# EAGLE board core (EAGLE 9.6.2), part 1 of 4
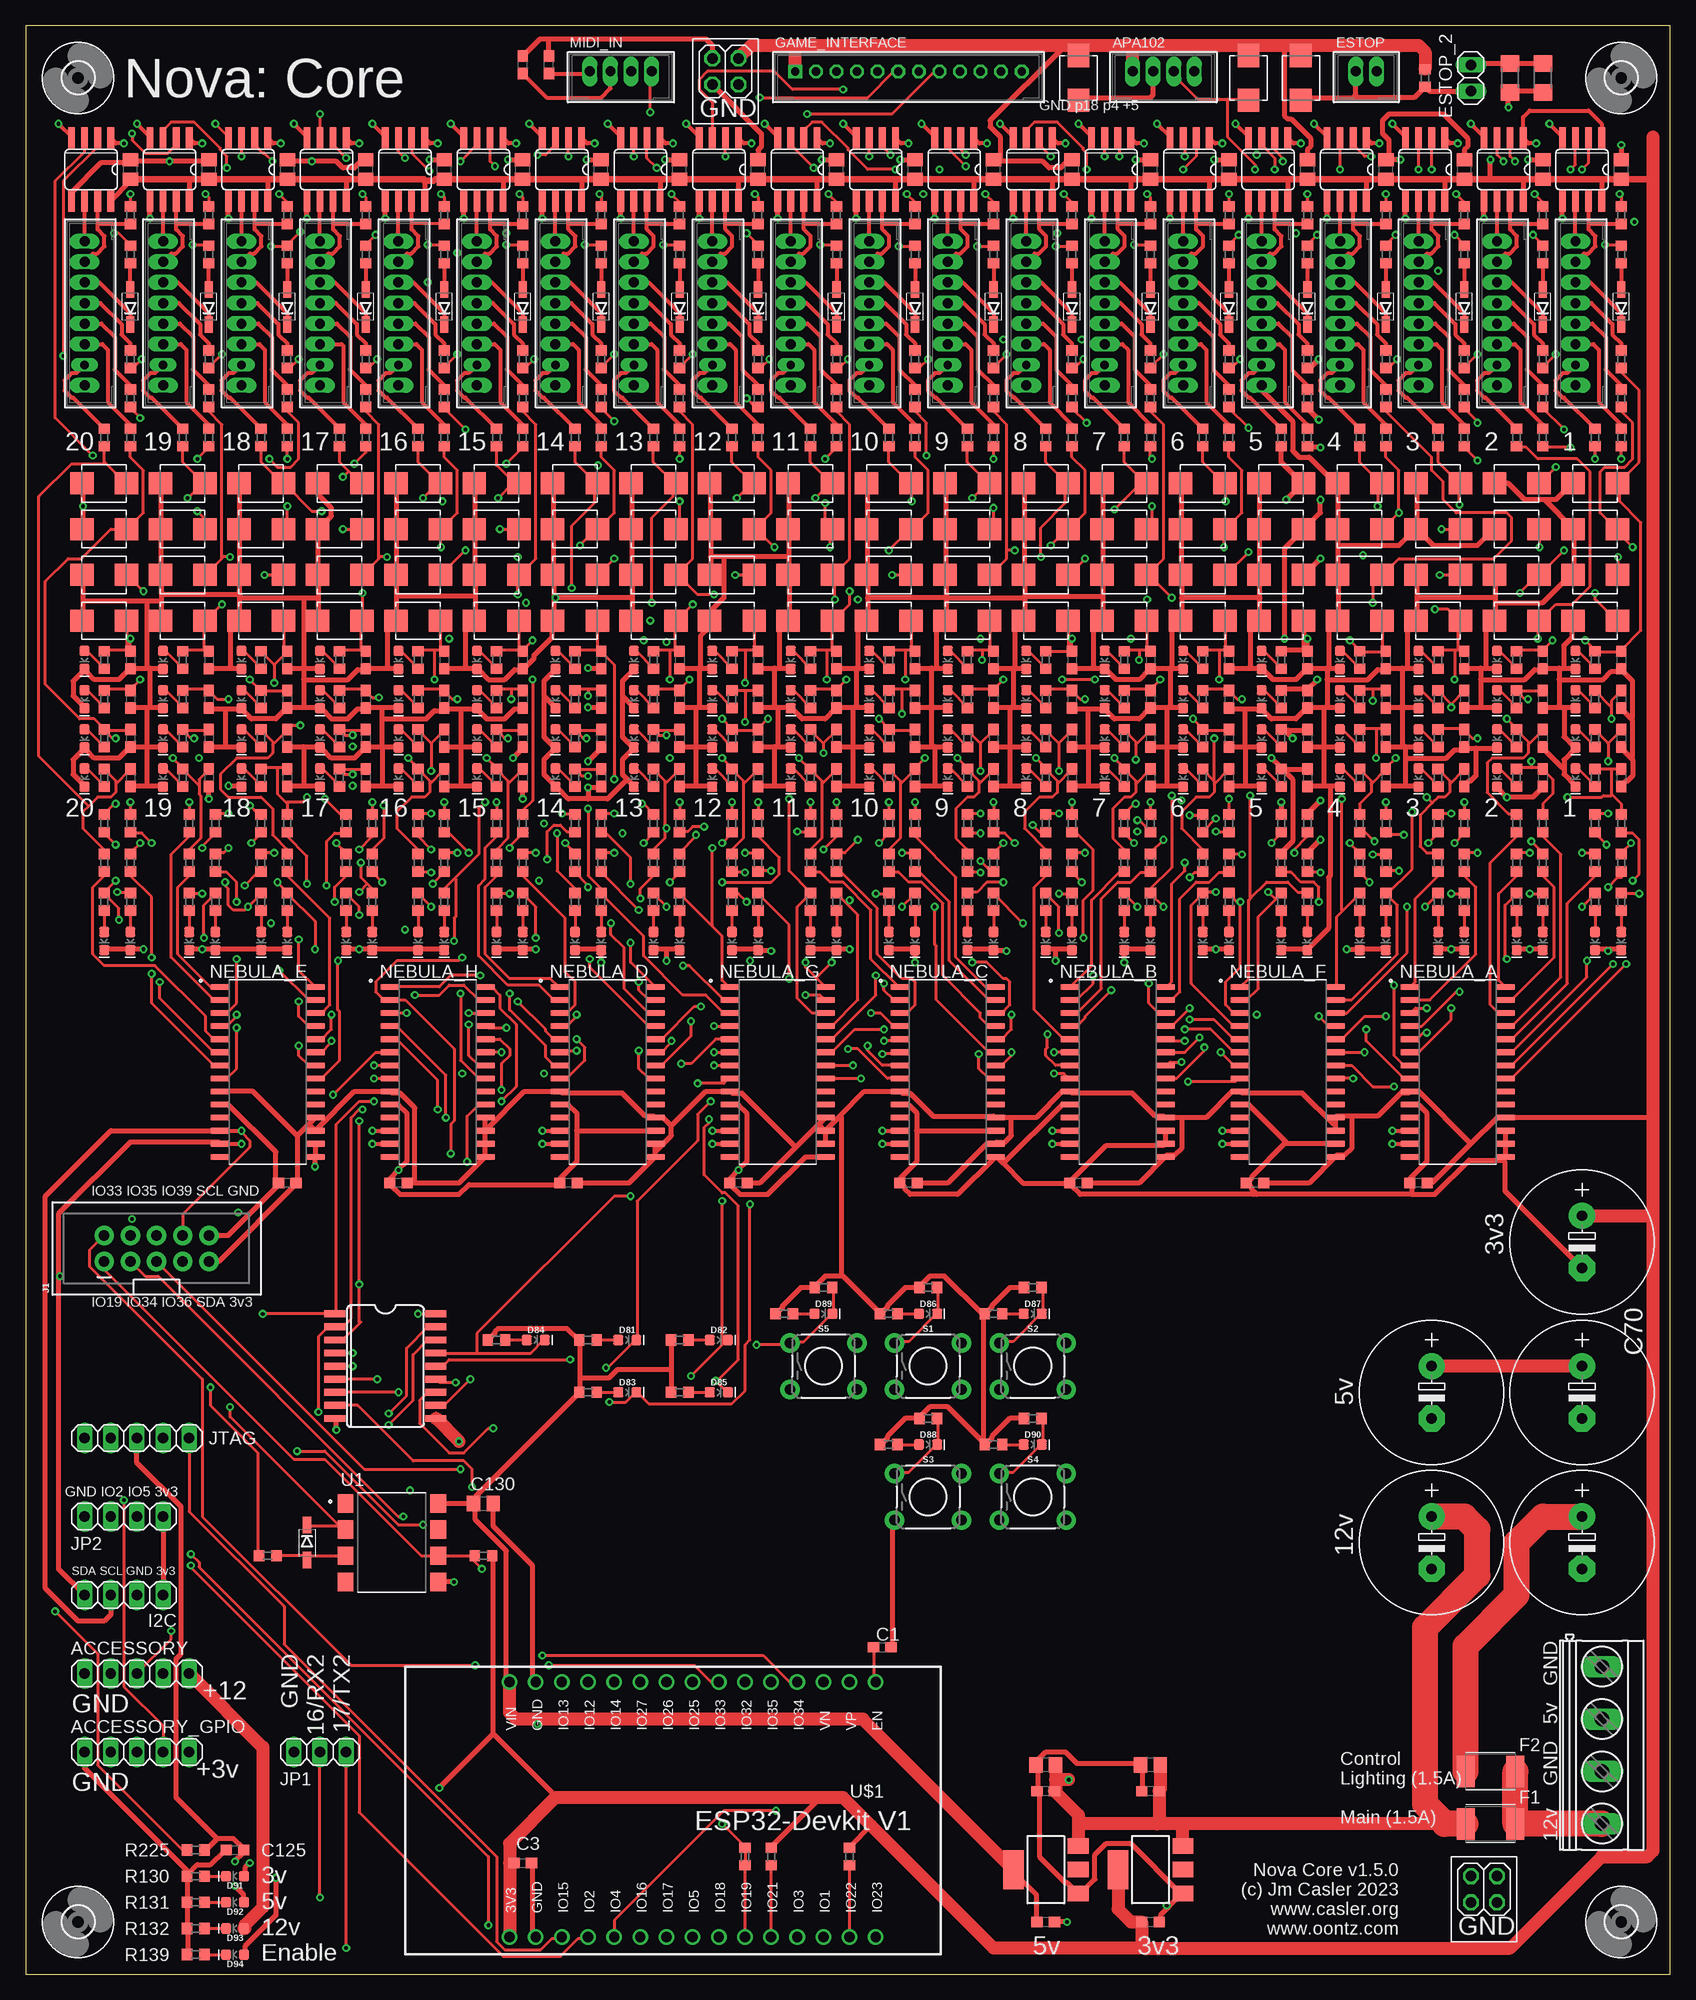
[diagram p5: board, top side]
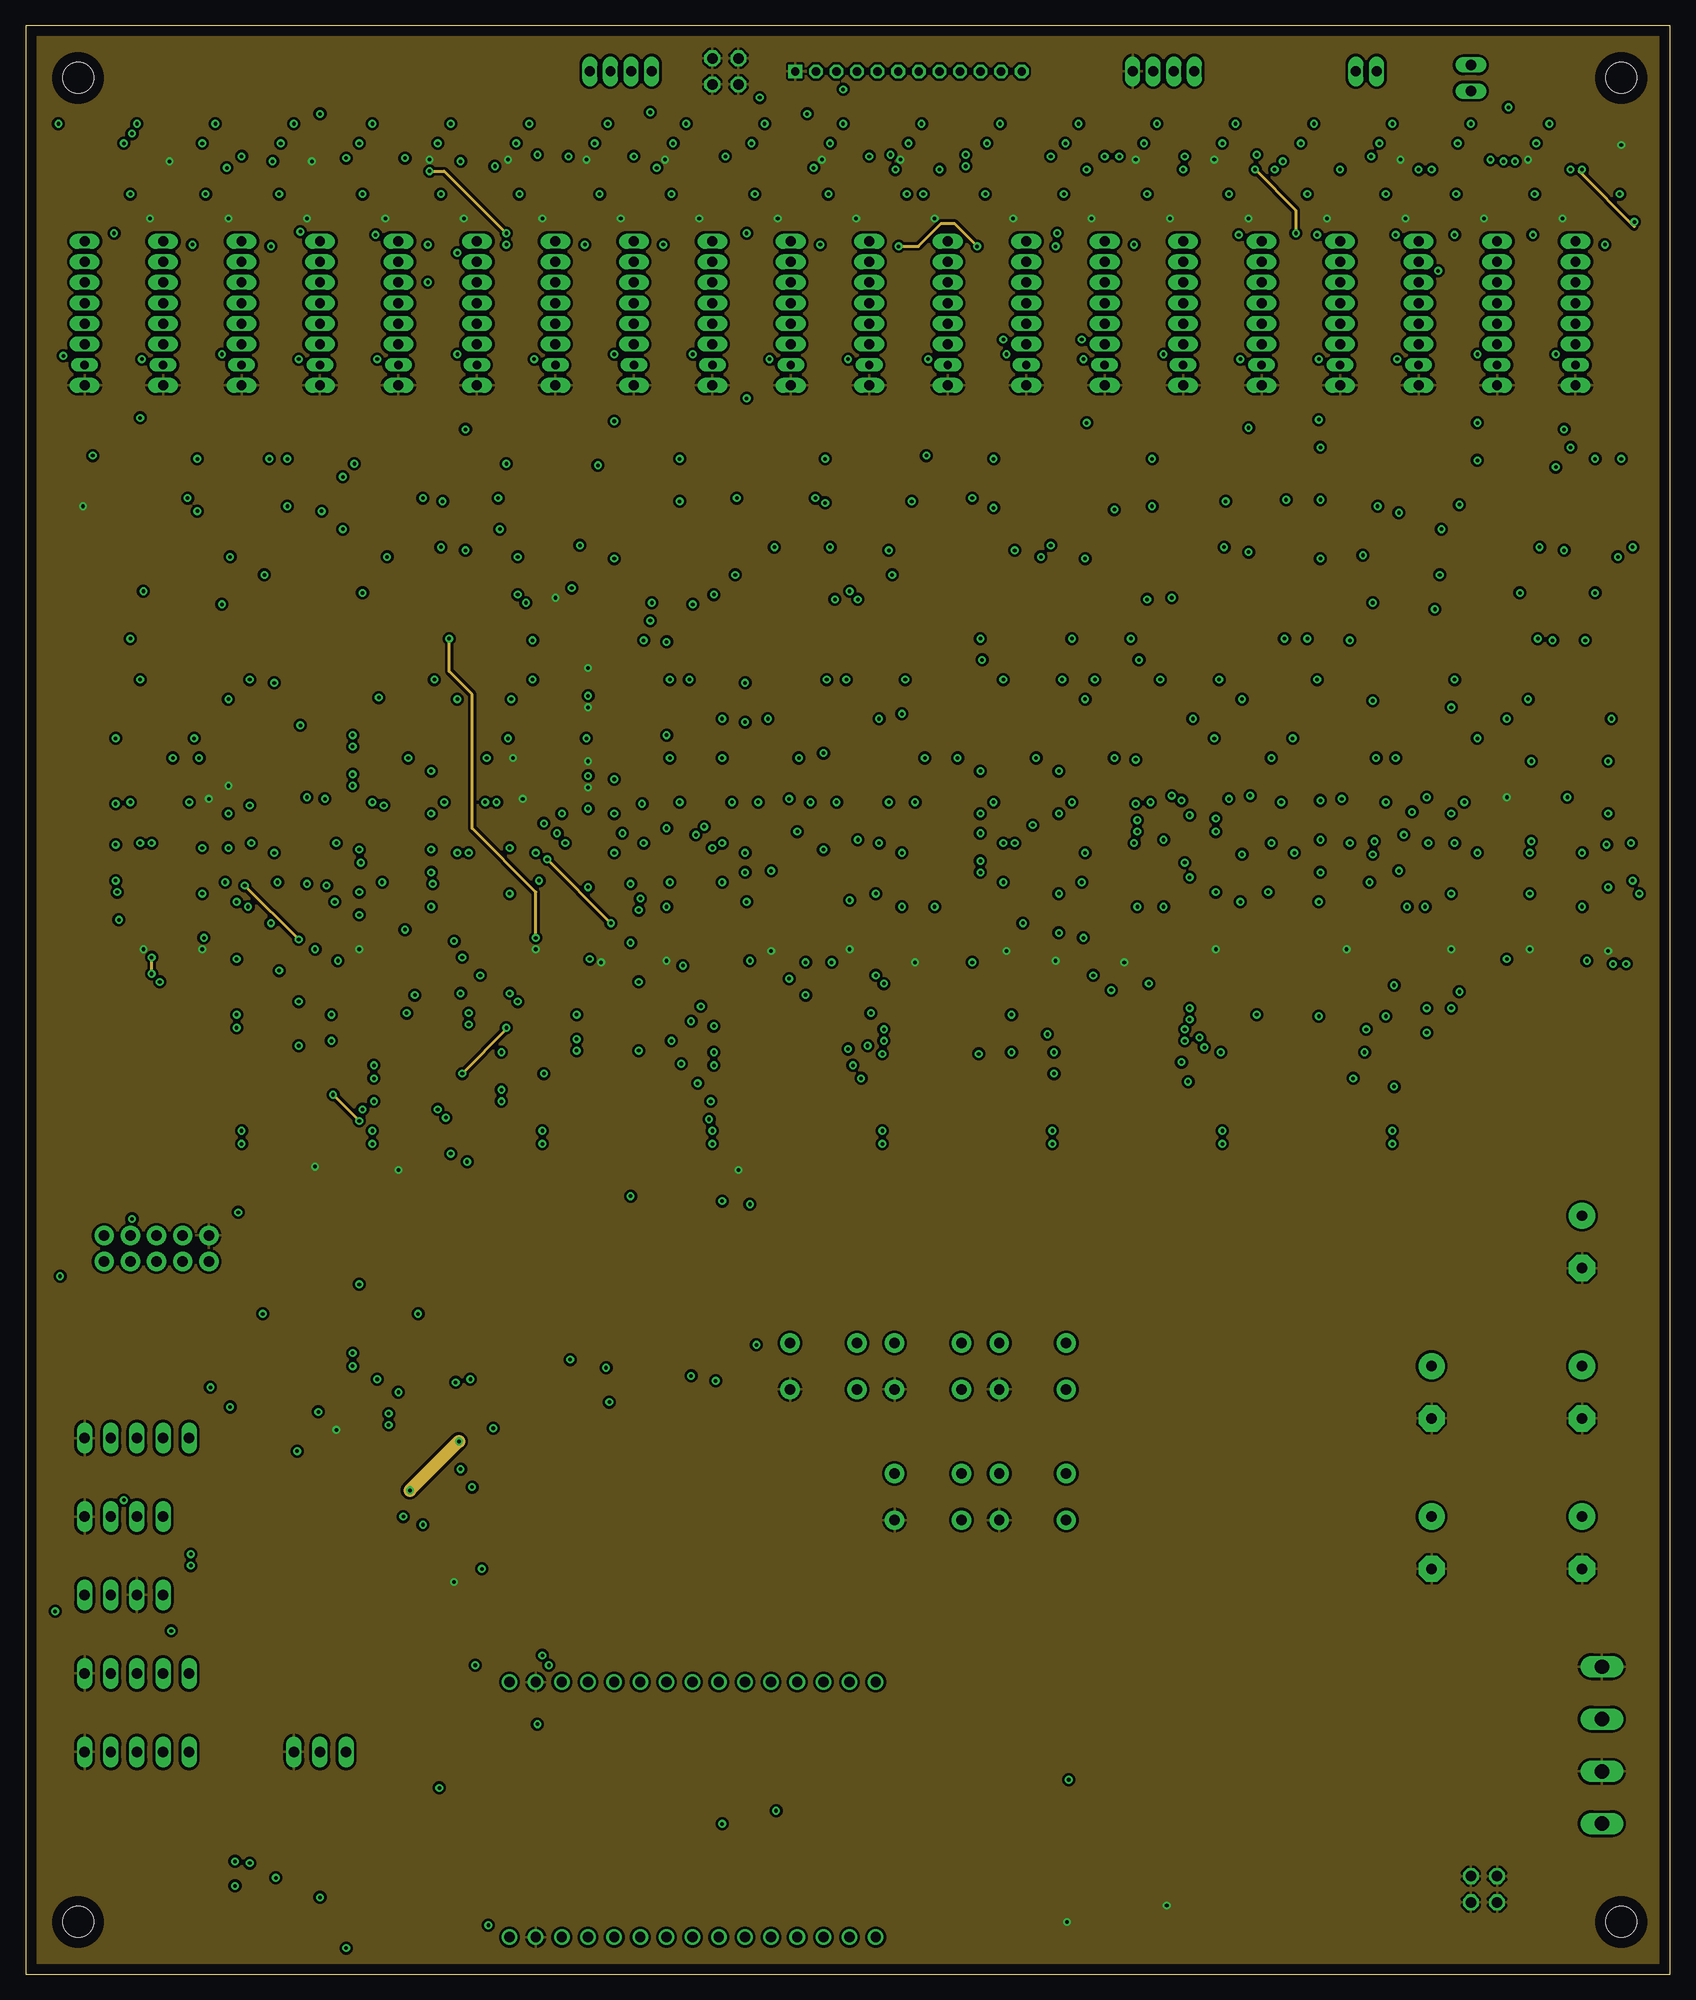
[diagram p6: board, inner layer $GND]
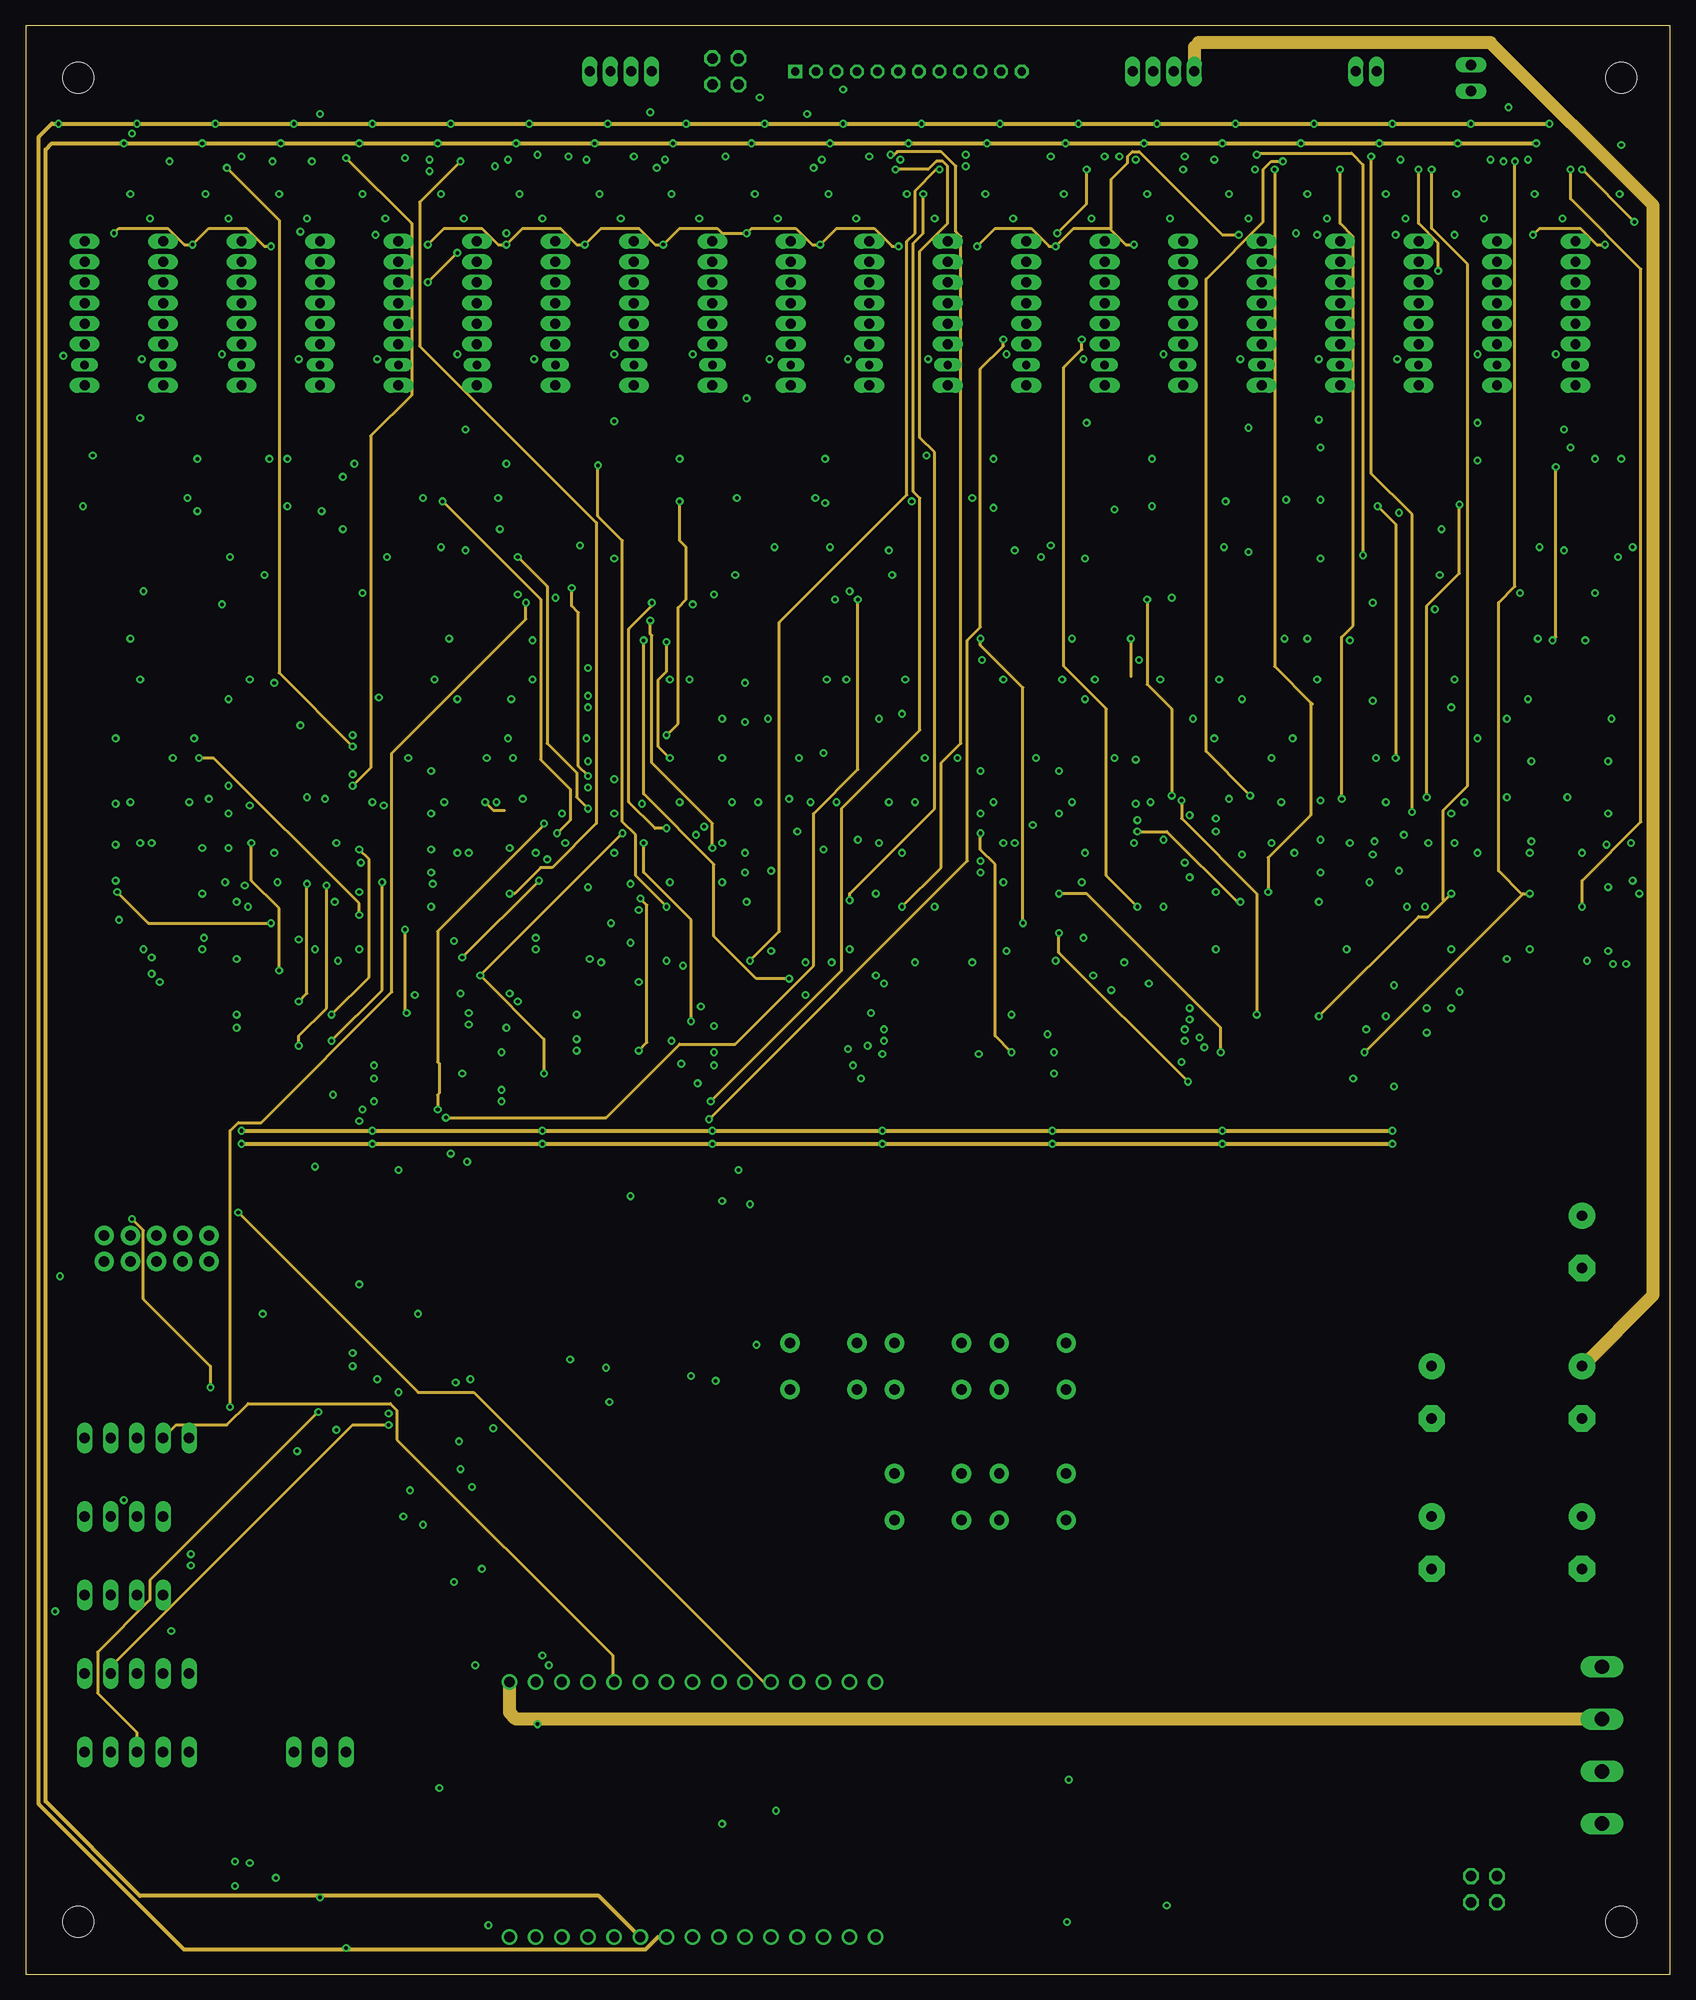
[diagram p7: board, inner layer SIGNAL3]
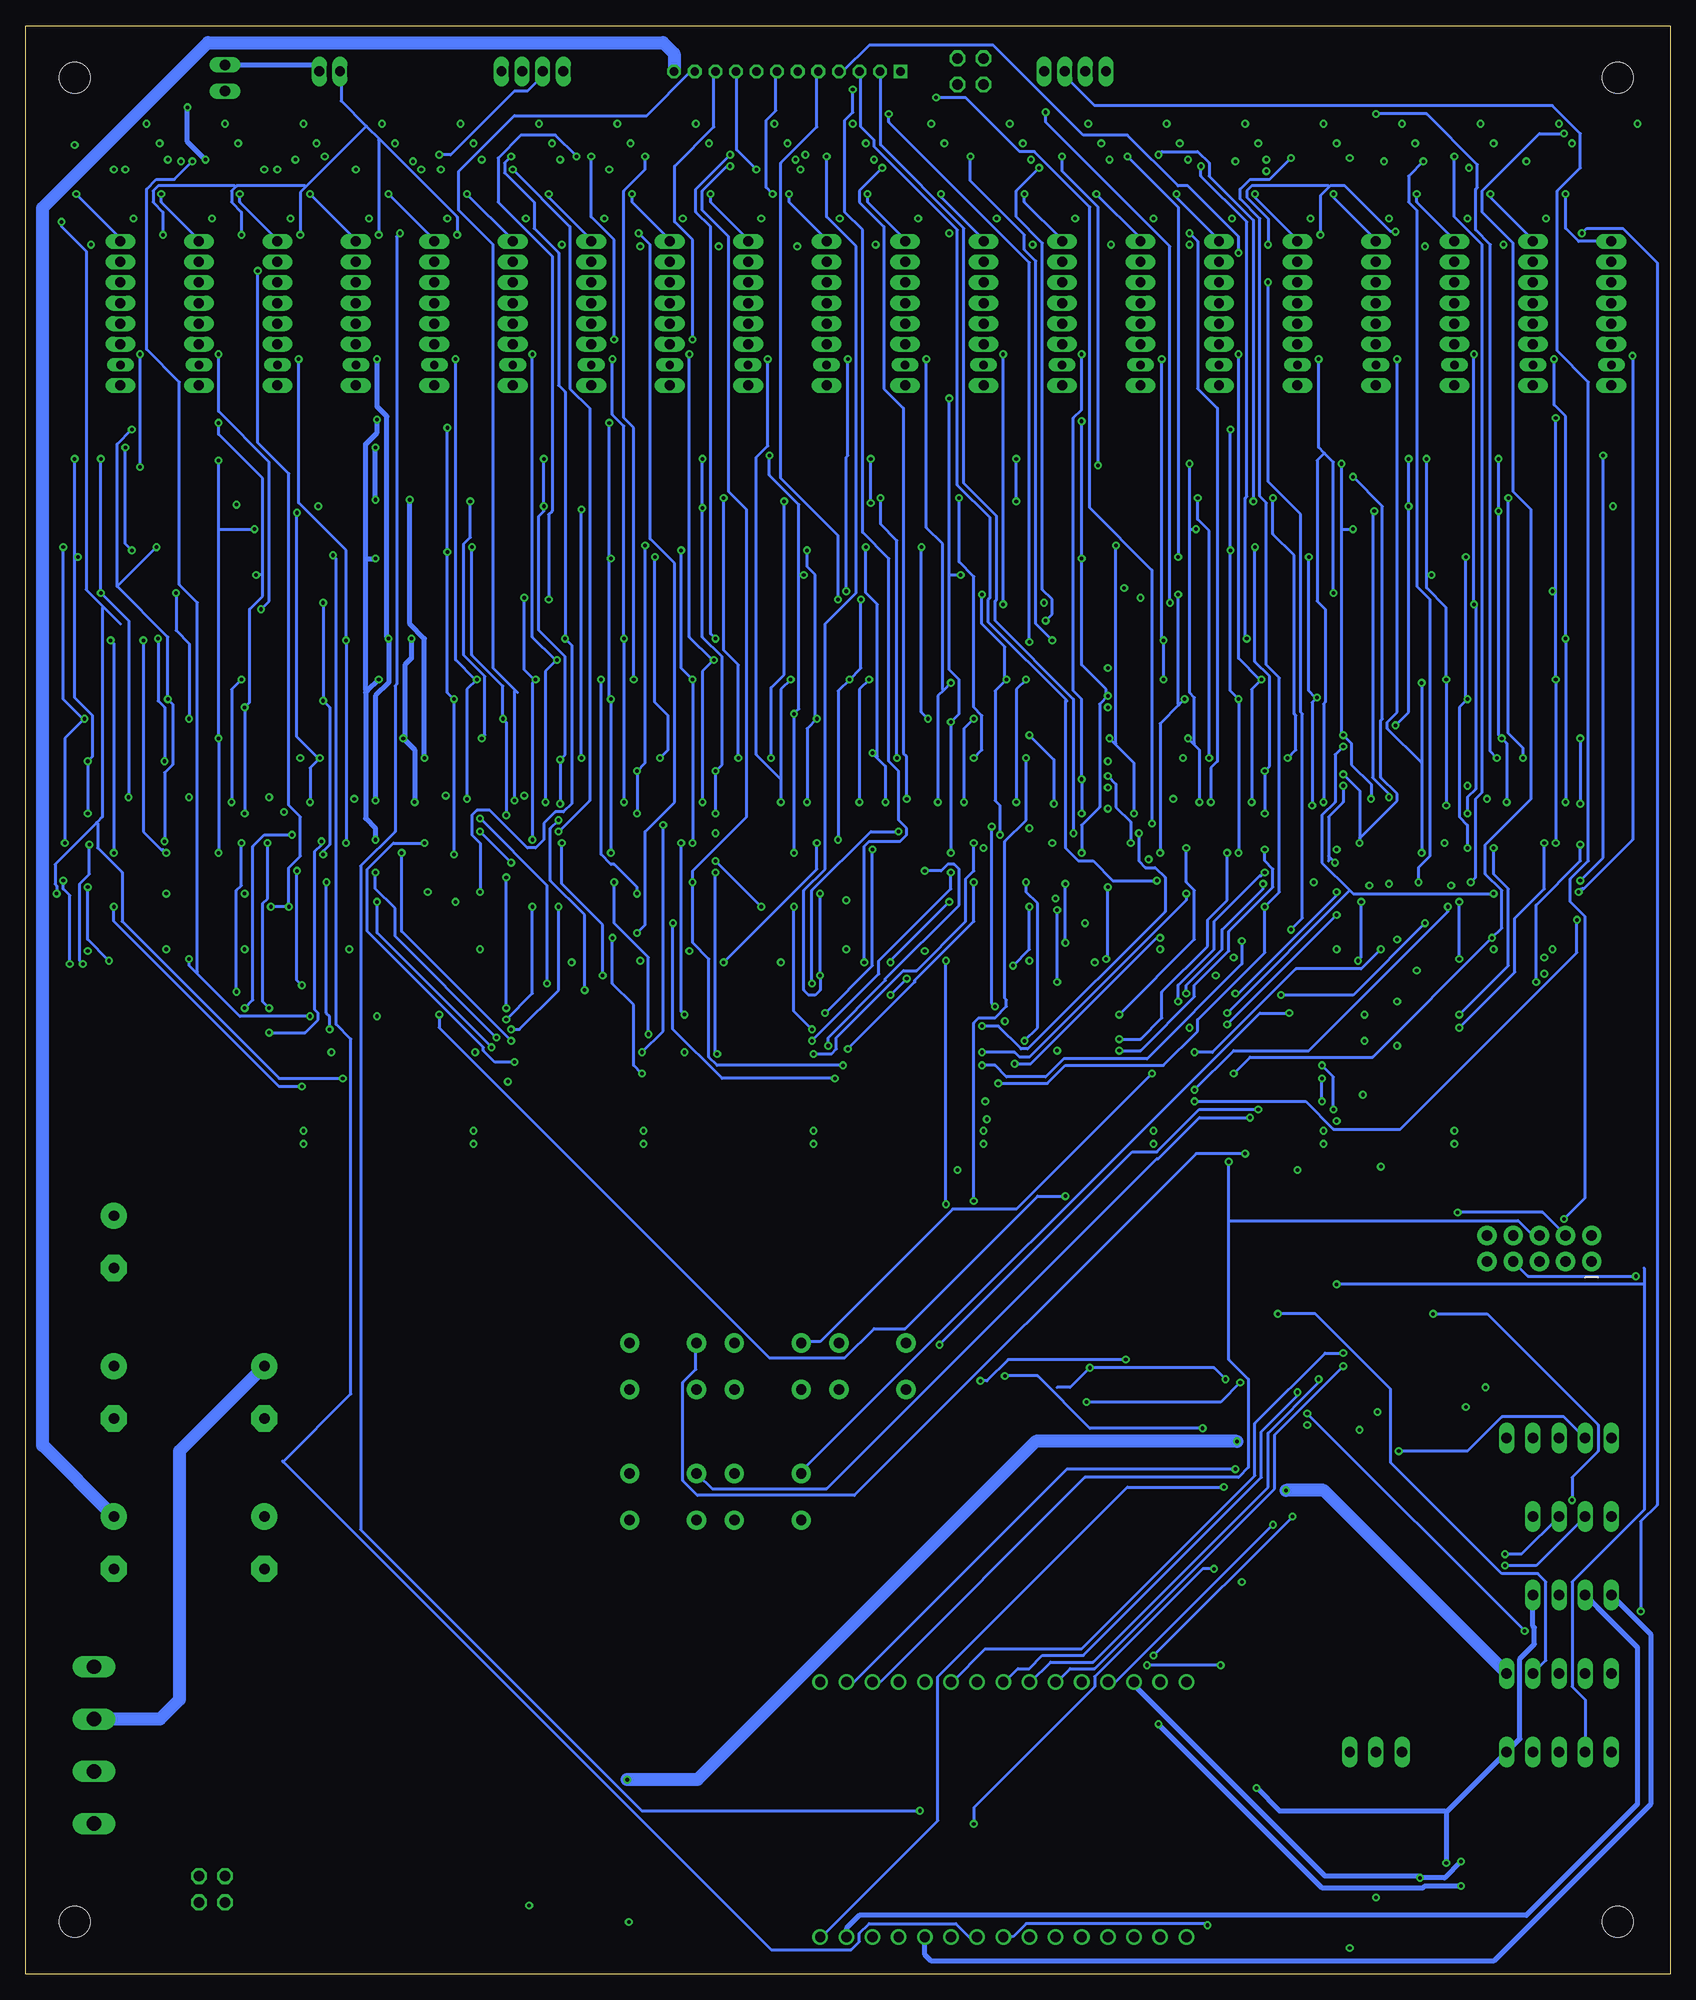
[diagram p8: board, bottom side, seen from below]

Size 159.69 x 189.22 mm. Coordinates in mm from the lower left corner, seen from the top.
Outline: 0,0 159.69,0 159.69,189.22 0,189.22 0,0
Copper layers (1+2*15+16): Top 0.035mm / dielectric 1.5mm / $GND 0.035mm / dielectric 0.15mm / SIGNAL3 0.035mm / dielectric 0.2mm / Bottom 0.035mm
Design rules "default *": minimum track width 6mil, minimum drill 0.35mm, track to track 6mil, track to pad 6mil, pad to pad 6mil, via to via 6mil, smd to smd 6mil, copper to edge 40mil, drill to drill 6mil, minimum pad ring 10mil, minimum via ring 8mil, stop-mask expansion 4mil, vias tented up to drill 20mil, thermal gap 10mil
Net classes: 0 default: width 0.305 mm, clearance 0.254 mm; 1 GND: width 0.508 mm, clearance 0.254 mm; 2 12V: width 1.27 mm, clearance 0.254 mm; 3 5V: width 0.508 mm, clearance 0.254 mm; 4 3V3: width 0.508 mm, clearance 0.254 mm

## Footprints (pad centres in the part's own frame; a part is rotated, then mirrored left to right if it is on the bottom)
1X05 = drill 1.016 long: 1 -5.08,0; 2 -2.54,0; 3 0,0; 4 2.54,0; 5 5.08,0
B4B-PH-K = drill 0.965 long: 1 -3,0; 2 -1,0; 3 1,0; 4 3,0
C0603 = smd 1.1 x 1: 1 -0.85,0; 2 0.85,0
C0805 = smd 1.3 x 1.5: 1 -0.95,0; 2 0.95,0
E5-13 = drill 1.016 pad 2.54: + -2.54,0 | drill 1.016 pad 2.54 octagon: - 2.54,0
LED-0603 = smd 1 x 1: A -0.877,0; C 0.877,0
SOD123 = smd 1.6 x 0.8: A 1.7,0; C -1.7,0
DIOM4336X265N = smd 2.28 x 2.12: 1 -2.165,0; 2 2.165,0
B2B-PH-K = drill 0.965 long: 1 -1,0; 2 1,0
1X02 = drill 1.016 long: 1 -1.27,0; 2 1.27,0
FUSC4632X160 = smd 1.73 x 3.05: 1 -2.415,0; 2 2.415,0
B12B-PH-K = drill 0.813 square: 1 -11,0 | drill 0.813 octagon: 2 -9,0; 3 -7,0; 4 -5,0; 5 -3,0; 6 -1,0; 7 1,0; 8 3,0; 9 5,0; 10 7,0; 11 9,0; 12 11,0
3,0 = hole 3: 0,0
1X04 = drill 1.016 long: 1 -3.81,0; 2 -1.27,0; 3 1.27,0; 4 3.81,0
SO08 = smd 0.66 x 2.032: 1 -1.905,-3.073; 2 -0.635,-3.073; 3 0.635,-3.073; 4 1.905,-3.073; 5 1.905,3.073; 6 0.635,3.073; 7 -0.635,3.073; 8 -1.905,3.073
SOT223 = smd 1.5 x 2: 1 -2.3,-3.15; 2 0,-3.15; 3 2.3,-3.15 | smd 3.8 x 2: 4 0,3.15
2X5-SHROUDED = drill 1.016 pad 1.88: 1 -1.27,5.08; 2 1.27,5.08; 3 -1.27,2.54; 4 1.27,2.54; 5 -1.27,0; 6 1.27,0; 7 -1.27,-2.54; 8 1.27,-2.54; 9 -1.27,-5.08; 10 1.27,-5.08
1X03 = drill 1.016 long: 1 -2.54,0; 2 0,0; 3 2.54,0
2X02 = drill 1.016 octagon: 1 -1.27,-1.27; 2 -1.27,1.27; 3 1.27,-1.27; 4 1.27,1.27
SOIC127P1030X265-28N = smd 1.9 x 0.6: 1 -4.605,8.255; 2 -4.605,6.985; 3 -4.605,5.715; 4 -4.605,4.445; 5 -4.605,3.175; 6 -4.605,1.905; 7 -4.605,0.635; 8 -4.605,-0.635; 9 -4.605,-1.905; 10 -4.605,-3.175; 11 -4.605,-4.445; 12 -4.605,-5.715; 13 -4.605,-6.985; 14 -4.605,-8.255; 15 4.605,-8.255; 16 4.605,-6.985; 17 4.605,-5.715; 18 4.605,-4.445; 19 4.605,-3.175; 20 4.605,-1.905; 21 4.605,-0.635; 22 4.605,0.635; 23 4.605,1.905; 24 4.605,3.175; 25 4.605,4.445; 26 4.605,5.715; 27 4.605,6.985; 28 4.605,8.255
MKDSN1,5/4-5,08 = drill 1.397 pad 2 long: 1 -7.641,0.025; 2 -2.561,0.025; 3 2.519,0.025; 4 7.599,0.025
R0603 = smd 1 x 1.1: 1 -0.85,0; 2 0.85,0
R1206 = smd 1.6 x 1.803: 1 -1.422,0; 2 1.422,0
TACTILE_SWITCH_PTH_6.0MM = drill 1.016 pad 1.88: 1 -3.251,2.261; 2 3.251,2.261; 3 -3.251,-2.261; 4 3.251,-2.261
B8B-PH-K = drill 0.965 long: 1 -7,0; 3 -3,0; 4 -1,0; 5 1,0; 6 3,0; 7 5,0; 8 7,0 | drill 0.813 long: 2 -5,0
COUPL_6N138SDM = smd 1.52 x 1.78: 1 -4.505,3.81; 2 -4.505,1.27; 3 -4.505,-1.27; 4 -4.505,-3.81; 5 4.505,-3.81; 6 4.505,-1.27; 7 4.505,1.27; 8 4.505,3.81
ESP32-DEVKITV1 = drill 1 pad 1.422: 1 -22.87,-13.54; 2 -20.33,-13.54; 3 -17.79,-13.54; 4 -15.25,-13.54; 5 -12.71,-13.54; 6 -10.17,-13.54; 7 -7.63,-13.54; 8 -5.09,-13.54; 9 -2.55,-13.54; 10 -0.01,-13.54; 11 2.53,-13.54; 12 5.07,-13.54; 13 7.61,-13.54; 14 10.15,-13.54; 15 12.69,-13.54; 16 12.69,11.23; 17 10.15,11.23; 18 7.61,11.23; 19 5.07,11.23; 20 2.53,11.23; 21 -0.01,11.23; 22 -2.55,11.23; 23 -5.09,11.23; 24 -7.63,11.23; 25 -10.17,11.23; 26 -12.71,11.23; 27 -15.25,11.23; 28 -17.79,11.23; 29 -20.33,11.23; 30 -22.87,11.23
SO18L = smd 0.66 x 2.032: 1 -0.635,-4.902; 2 0.635,-4.902; 3 1.905,-4.902; 4 3.175,-4.902; 5 4.445,-4.902; 6 5.715,-4.902; 7 6.985,-4.902; 8 8.255,-4.902; 9 9.525,-4.902; 10 9.525,4.902; 11 8.255,4.902; 12 6.985,4.902; 13 5.715,4.902; 14 4.445,4.902; 15 3.175,4.902; 16 1.905,4.902; 17 0.635,4.902; 18 -0.635,4.902

## Placement (x,y rotation side)
ACCESSORY  [1X05]  10.79,29.21 0 top
ACCESSORY_GPIO  [1X05]  10.79,21.59 0 top
APA102  B4B-PH-K  [B4B-PH-K]  110.49,184.78 0 top
C1  10uf  [C0603]  83.19,31.75 0 top
C2  10uf  [C0603]  99.06,17.78 180 top
C3  10uf  [C0603]  48.26,10.79 0 top
C4  1uf  [C0805]  99.06,20.32 180 top
C5  10uf  [C0603]  99.06,5.08 0 top
C6  1uf  [C0805]  109.22,20.32 180 top
C7  10uf  [C0603]  25.4,76.83 180 top
C8  10uf  [C0603]  135.25,76.83 180 top
C9  10uf  [C0603]  85.72,76.83 180 top
C10  10uf  [C0603]  102.23,76.83 180 top
C11  10uf  [C0603]  52.7,76.83 180 top
C12  10uf  [C0603]  119.38,76.83 180 top
C13  10uf  [C0603]  69.22,76.83 180 top
C14  1uf  [C0805]  154.94,175.26 90 top
C15  1uf  [C0805]  147.32,175.26 90 top
C16  1uf  [C0805]  139.7,175.26 90 top
C17  1uf  [C0805]  132.08,175.26 90 top
C18  1uf  [C0805]  124.46,175.26 90 top
C19  1uf  [C0805]  116.84,175.26 90 top
C20  1uf  [C0805]  109.22,175.26 90 top
C21  1uf  [C0805]  101.6,175.26 90 top
C22  1uf  [C0805]  93.98,175.26 90 top
C23  1uf  [C0805]  86.36,175.26 90 top
C24  1uf  [C0805]  78.74,175.26 90 top
C25  1uf  [C0805]  71.12,175.26 90 top
C26  1uf  [C0805]  10.16,175.26 90 top
C27  1uf  [C0805]  17.78,175.26 90 top
C28  1uf  [C0805]  25.4,175.26 90 top
C29  1uf  [C0805]  33.02,175.26 90 top
C30  1uf  [C0805]  40.64,175.26 90 top
C31  1uf  [C0805]  48.26,175.26 90 top
C32  1uf  [C0805]  55.88,175.26 90 top
C33  1uf  [C0805]  63.5,175.26 90 top
C34  10uf  [C0603]  36.2,76.83 180 top
C35  10uf  [C0603]  109.22,17.78 180 top
C36  10uf  [C0603]  109.22,5.08 0 top
C37  100nf  [C0603]  154.94,116.2 270 top
C38  100nf  [C0603]  154.94,120.02 270 top
C39  100nf  [C0603]  154.94,123.83 270 top
C40  100nf  [C0603]  154.94,127.64 270 top
C41  100nf  [C0603]  147.32,116.2 270 top
C42  100nf  [C0603]  147.32,120.02 270 top
C43  100nf  [C0603]  147.32,123.83 270 top
C44  100nf  [C0603]  147.32,127.64 270 top
C45  100nf  [C0603]  139.7,116.2 270 top
C46  100nf  [C0603]  139.7,120.02 270 top
C47  100nf  [C0603]  139.7,123.83 270 top
C48  100nf  [C0603]  139.7,127.64 270 top
C49  100nf  [C0603]  132.08,116.2 270 top
C50  100nf  [C0603]  132.08,120.02 270 top
C51  100nf  [C0603]  132.08,123.83 270 top
C52  100nf  [C0603]  132.08,127.64 270 top
C53  100nf  [C0603]  124.46,116.2 270 top
C54  100nf  [C0603]  124.46,120.02 270 top
C55  100nf  [C0603]  124.46,123.83 270 top
C56  100nf  [C0603]  124.46,127.64 270 top
C57  100nf  [C0603]  116.84,116.2 270 top
C58  100nf  [C0603]  116.84,120.02 270 top
C59  100nf  [C0603]  116.84,123.83 270 top
C60  100nf  [C0603]  116.84,127.64 270 top
C61  100nf  [C0603]  109.22,116.2 270 top
C62  100nf  [C0603]  109.22,120.02 270 top
C63  100nf  [C0603]  109.22,123.83 270 top
C64  100nf  [C0603]  109.22,127.64 270 top
C65  100nf  [C0603]  101.6,116.2 270 top
C66  100nf  [C0603]  101.6,120.02 270 top
C67  100nf  [C0603]  101.6,123.83 270 top
C68  100nf  [C0603]  101.6,127.64 270 top
C69  470uf  [E5-13]  151.13,56.52 270 top
C70  470uf  [E5-13]  151.13,71.12 270 top
C71  470uf  [E5-13]  136.53,56.52 270 top
C73  100nf  [C0603]  93.98,116.2 270 top
C74  100nf  [C0603]  93.98,120.02 270 top
C75  100nf  [C0603]  93.98,123.83 270 top
C76  100nf  [C0603]  93.98,127.64 270 top
C77  100nf  [C0603]  86.36,116.2 270 top
C78  100nf  [C0603]  86.36,120.02 270 top
C79  100nf  [C0603]  86.36,123.83 270 top
C80  100nf  [C0603]  86.36,127.64 270 top
C81  100nf  [C0603]  78.74,116.2 270 top
C82  100nf  [C0603]  78.74,120.02 270 top
C83  100nf  [C0603]  78.74,123.83 270 top
C84  100nf  [C0603]  78.74,127.64 270 top
C85  100nf  [C0603]  71.12,116.2 270 top
C86  100nf  [C0603]  71.12,120.02 270 top
C87  100nf  [C0603]  71.12,123.83 270 top
C88  100nf  [C0603]  71.12,127.64 270 top
C89  2200uf  [E5-13]  136.53,41.91 270 top
C90  2200uf  [E5-13]  151.13,41.91 270 top
C93  100nf  [C0603]  63.5,116.2 270 top
C94  100nf  [C0603]  63.5,120.02 270 top
C95  100nf  [C0603]  63.5,123.83 270 top
C96  100nf  [C0603]  63.5,127.64 270 top
C97  100nf  [C0603]  48.26,116.2 270 top
C98  100nf  [C0603]  48.26,120.02 270 top
C99  100nf  [C0603]  48.26,123.83 270 top
C100  100nf  [C0603]  48.26,127.64 270 top
C101  100nf  [C0603]  55.88,116.2 270 top
C102  100nf  [C0603]  55.88,120.02 270 top
C103  100nf  [C0603]  55.88,123.83 270 top
C104  100nf  [C0603]  55.88,127.64 270 top
C105  100nf  [C0603]  40.64,116.2 270 top
C106  100nf  [C0603]  40.64,120.02 270 top
C107  100nf  [C0603]  40.64,123.83 270 top
C108  100nf  [C0603]  40.64,127.64 270 top
C109  100nf  [C0603]  33.02,116.2 270 top
C110  100nf  [C0603]  33.02,120.02 270 top
C111  100nf  [C0603]  33.02,123.83 270 top
C112  100nf  [C0603]  33.02,127.64 270 top
C113  100nf  [C0603]  25.4,116.2 270 top
C114  100nf  [C0603]  25.4,120.02 270 top
C115  100nf  [C0603]  25.4,123.83 270 top
C116  100nf  [C0603]  25.4,127.64 270 top
C117  100nf  [C0603]  17.78,116.2 270 top
C118  100nf  [C0603]  17.78,120.02 270 top
C119  100nf  [C0603]  17.78,123.83 270 top
C120  100nf  [C0603]  17.78,127.64 270 top
C121  100nf  [C0603]  10.16,116.2 270 top
C122  100nf  [C0603]  10.16,120.02 270 top
C123  100nf  [C0603]  10.16,123.83 270 top
C124  1nf  [C0603]  10.16,127.64 270 top
C125  C_1NF/50V_0603  [C0603]  20.32,12.06 0 top
C126  C_100NF/50V_0603  [C0603]  50.8,185.42 90 top
C127  C_100NF/50V_0603  [C0603]  48.26,185.42 90 top
C130  1uf  [C0805]  44.45,45.72 0 top
D1  [LED-0603]  59.05,116.2 270 top
D2  [LED-0603]  150.5,116.2 270 top
D3  [LED-0603]  150.5,120.02 270 top
D4  [LED-0603]  150.5,123.83 270 top
D5  [LED-0603]  150.5,127.64 270 top
D6  [LED-0603]  142.88,116.2 270 top
D7  [LED-0603]  142.88,120.02 270 top
D8  [LED-0603]  142.88,123.83 270 top
D9  [LED-0603]  142.88,127.64 270 top
D10  [LED-0603]  135.25,116.2 270 top
D11  [LED-0603]  135.25,120.02 270 top
D12  [LED-0603]  135.25,123.83 270 top
D13  [LED-0603]  135.25,127.64 270 top
D14  [LED-0603]  127.64,116.2 270 top
D15  [LED-0603]  127.64,120.02 270 top
D16  [LED-0603]  127.64,123.83 270 top
D17  [LED-0603]  127.64,127.64 270 top
D18  [LED-0603]  120.02,116.2 270 top
D19  [LED-0603]  120.02,120.02 270 top
D20  [LED-0603]  120.02,123.83 270 top
D21  [LED-0603]  120.02,127.64 270 top
D22  [LED-0603]  112.39,116.2 270 top
D23  [LED-0603]  112.39,120.02 270 top
D24  [LED-0603]  112.39,123.83 270 top
D25  [LED-0603]  112.39,127.64 270 top
D26  [LED-0603]  104.78,116.2 270 top
D27  [LED-0603]  104.78,120.02 270 top
D28  [LED-0603]  104.78,123.83 270 top
D29  [LED-0603]  104.78,127.64 270 top
D30  [LED-0603]  97.16,116.2 270 top
D31  [LED-0603]  97.16,120.02 270 top
D32  [LED-0603]  97.16,123.83 270 top
D33  [LED-0603]  97.16,127.64 270 top
D34  [LED-0603]  89.53,116.2 270 top
D35  [LED-0603]  89.53,120.02 270 top
D36  [LED-0603]  89.53,123.83 270 top
D37  [LED-0603]  89.53,127.64 270 top
D38  [LED-0603]  81.92,116.2 270 top
D39  [LED-0603]  81.92,120.02 270 top
D40  [LED-0603]  81.92,123.83 270 top
D41  [LED-0603]  81.92,127.64 270 top
D42  [LED-0603]  74.3,116.2 270 top
D43  [LED-0603]  74.3,120.02 270 top
D44  [LED-0603]  74.3,123.83 270 top
D45  [LED-0603]  74.3,127.64 270 top
D46  [LED-0603]  66.67,116.2 270 top
D47  [LED-0603]  66.67,120.02 270 top
D48  [LED-0603]  66.67,123.83 270 top
D49  [LED-0603]  66.67,127.64 270 top
D50  [LED-0603]  59.05,120.02 270 top
D51  [LED-0603]  59.05,123.83 270 top
D52  [LED-0603]  59.05,127.64 270 top
D53  [LED-0603]  51.44,116.2 270 top
D54  [LED-0603]  51.44,120.02 270 top
D55  [LED-0603]  51.44,123.83 270 top
D56  [LED-0603]  51.44,127.64 270 top
D57  [LED-0603]  43.81,116.2 270 top
D58  [LED-0603]  43.81,120.02 270 top
D59  [LED-0603]  43.81,123.83 270 top
D60  [LED-0603]  43.81,127.64 270 top
D61  [LED-0603]  36.2,116.2 270 top
D62  [LED-0603]  36.2,120.02 270 top
D63  [LED-0603]  36.2,123.83 270 top
D64  [LED-0603]  36.2,127.64 270 top
D65  [LED-0603]  28.57,116.2 270 top
D66  [LED-0603]  28.57,120.02 270 top
D67  [LED-0603]  28.57,123.83 270 top
D68  [LED-0603]  28.57,127.64 270 top
D69  [LED-0603]  20.95,116.2 270 top
D70  [LED-0603]  20.95,120.02 270 top
D71  [LED-0603]  20.95,123.83 270 top
D72  [LED-0603]  20.95,127.64 270 top
D73  [LED-0603]  13.34,116.2 270 top
D74  [LED-0603]  13.34,120.02 270 top
D75  [LED-0603]  13.34,123.83 270 top
D76  [LED-0603]  13.34,127.64 270 top
D77  [LED-0603]  5.71,116.2 270 top
D78  [LED-0603]  5.71,120.02 270 top
D79  [LED-0603]  5.71,123.83 270 top
D80  [LED-0603]  5.71,127.64 270 top
D81  red  [LED-0603]  58.42,61.59 0 top
D82  green  [LED-0603]  67.31,61.59 0 top
D83  blue  [LED-0603]  58.42,56.52 0 top
D84  white  [LED-0603]  49.53,61.59 0 top
D85  yellow  [LED-0603]  67.31,56.52 0 top
D86  red  [LED-0603]  87.63,64.14 0 top
D87  green  [LED-0603]  97.79,64.14 0 top
D88  blue  [LED-0603]  87.63,51.44 0 top
D89  white  [LED-0603]  77.47,64.14 0 top
D90  yellow  [LED-0603]  97.79,51.44 0 top
D91  red  [LED-0603]  20.32,9.53 180 top
D92  green  [LED-0603]  20.32,6.99 180 top
D93  blue  [LED-0603]  20.32,4.45 180 top
D94  yellow  [LED-0603]  20.32,1.91 180 top
D95  D_B5819W-SL_CHANGJ_SOD123  [SOD123]  154.94,161.93 90 top
D96  D_B5819W-SL_CHANGJ_SOD123  [SOD123]  147.32,161.93 90 top
D97  D_B5819W-SL_CHANGJ_SOD123  [SOD123]  139.7,161.93 90 top
D98  D_B5819W-SL_CHANGJ_SOD123  [SOD123]  132.08,161.93 90 top
D99  D_B5819W-SL_CHANGJ_SOD123  [SOD123]  124.46,161.93 90 top
D100  D_B5819W-SL_CHANGJ_SOD123  [SOD123]  116.84,161.93 90 top
D101  D_B5819W-SL_CHANGJ_SOD123  [SOD123]  109.22,161.93 90 top
D102  D_B5819W-SL_CHANGJ_SOD123  [SOD123]  101.6,161.93 90 top
D103  D_B5819W-SL_CHANGJ_SOD123  [SOD123]  93.98,161.93 90 top
D104  D_B5819W-SL_CHANGJ_SOD123  [SOD123]  63.5,161.93 90 top
D105  D_B5819W-SL_CHANGJ_SOD123  [SOD123]  33.02,161.93 90 top
D106  D_B5819W-SL_CHANGJ_SOD123  [SOD123]  86.36,161.93 90 top
D107  D_B5819W-SL_CHANGJ_SOD123  [SOD123]  78.74,161.93 90 top
D108  D_B5819W-SL_CHANGJ_SOD123  [SOD123]  71.12,161.93 90 top
D109  D_B5819W-SL_CHANGJ_SOD123  [SOD123]  55.88,161.93 90 top
D110  D_B5819W-SL_CHANGJ_SOD123  [SOD123]  48.26,161.93 90 top
D111  D_B5819W-SL_CHANGJ_SOD123  [SOD123]  40.64,161.93 90 top
D112  D_B5819W-SL_CHANGJ_SOD123  [SOD123]  25.4,161.93 90 top
D113  D_B5819W-SL_CHANGJ_SOD123  [SOD123]  17.78,161.93 90 top
D114  D_B5819W-SL_CHANGJ_SOD123  [SOD123]  10.16,161.93 90 top
D115  SMBJ8.0CA  [DIOM4336X265N]  152.4,135.89 0 top
D116  SMBJ8.0CA  [DIOM4336X265N]  152.4,131.44 0 top
D117  SMBJ8.0CA  [DIOM4336X265N]  152.4,140.34 0 top
D118  SMBJ8.0CA  [DIOM4336X265N]  152.4,144.78 0 top
D119  SMBJ8.0CA  [DIOM4336X265N]  144.78,131.44 0 top
D120  SMBJ8.0CA  [DIOM4336X265N]  144.78,135.89 0 top
D121  SMBJ8.0CA  [DIOM4336X265N]  144.78,140.34 0 top
D122  SMBJ8.0CA  [DIOM4336X265N]  144.78,144.78 0 top
D123  SMBJ8.0CA  [DIOM4336X265N]  137.16,144.78 0 top
D124  SMBJ8.0CA  [DIOM4336X265N]  137.16,140.34 0 top
D125  SMBJ8.0CA  [DIOM4336X265N]  137.16,135.89 0 top
D126  SMBJ8.0CA  [DIOM4336X265N]  137.16,131.44 0 top
D127  SMBJ8.0CA  [DIOM4336X265N]  129.54,144.78 0 top
D128  SMBJ8.0CA  [DIOM4336X265N]  129.54,140.34 0 top
D129  SMBJ8.0CA  [DIOM4336X265N]  129.54,135.89 0 top
D130  SMBJ8.0CA  [DIOM4336X265N]  129.54,131.44 0 top
D131  SMBJ8.0CA  [DIOM4336X265N]  121.92,144.78 0 top
D132  SMBJ8.0CA  [DIOM4336X265N]  121.92,140.34 0 top
D133  SMBJ8.0CA  [DIOM4336X265N]  121.92,135.89 0 top
D134  SMBJ8.0CA  [DIOM4336X265N]  121.92,131.44 0 top
D135  SMBJ8.0CA  [DIOM4336X265N]  114.3,144.78 0 top
D136  SMBJ8.0CA  [DIOM4336X265N]  114.3,140.34 0 top
D137  SMBJ8.0CA  [DIOM4336X265N]  114.3,135.89 0 top
D138  SMBJ8.0CA  [DIOM4336X265N]  114.3,131.44 0 top
D139  SMBJ8.0CA  [DIOM4336X265N]  106.68,144.78 0 top
D140  SMBJ8.0CA  [DIOM4336X265N]  106.68,140.34 0 top
D141  SMBJ8.0CA  [DIOM4336X265N]  106.68,135.89 0 top
D142  SMBJ8.0CA  [DIOM4336X265N]  106.68,131.44 0 top
D143  SMBJ8.0CA  [DIOM4336X265N]  99.06,144.78 0 top
D144  SMBJ8.0CA  [DIOM4336X265N]  99.06,140.34 0 top
D145  SMBJ8.0CA  [DIOM4336X265N]  99.06,135.89 0 top
D146  SMBJ8.0CA  [DIOM4336X265N]  99.06,131.44 0 top
D147  SMBJ8.0CA  [DIOM4336X265N]  91.44,144.78 0 top
D148  SMBJ8.0CA  [DIOM4336X265N]  91.44,140.34 0 top
D149  SMBJ8.0CA  [DIOM4336X265N]  91.44,135.89 0 top
D150  SMBJ8.0CA  [DIOM4336X265N]  91.44,131.44 0 top
D151  SMBJ8.0CA  [DIOM4336X265N]  83.82,144.78 0 top
D152  SMBJ8.0CA  [DIOM4336X265N]  83.82,140.34 0 top
D153  SMBJ8.0CA  [DIOM4336X265N]  83.82,135.89 0 top
D154  SMBJ8.0CA  [DIOM4336X265N]  83.82,131.44 0 top
D155  SMBJ8.0CA  [DIOM4336X265N]  76.2,144.78 0 top
D156  SMBJ8.0CA  [DIOM4336X265N]  76.2,140.34 0 top
D157  SMBJ8.0CA  [DIOM4336X265N]  76.2,135.89 0 top
D158  SMBJ8.0CA  [DIOM4336X265N]  76.2,131.44 0 top
D159  SMBJ8.0CA  [DIOM4336X265N]  68.58,144.78 0 top
D160  SMBJ8.0CA  [DIOM4336X265N]  68.58,140.34 0 top
D161  SMBJ8.0CA  [DIOM4336X265N]  68.58,135.89 0 top
D162  SMBJ8.0CA  [DIOM4336X265N]  68.58,131.44 0 top
D163  SMBJ8.0CA  [DIOM4336X265N]  60.96,144.78 0 top
D164  SMBJ8.0CA  [DIOM4336X265N]  60.96,140.34 0 top
D165  SMBJ8.0CA  [DIOM4336X265N]  60.96,135.89 0 top
D166  SMBJ8.0CA  [DIOM4336X265N]  60.96,131.44 0 top
D167  SMBJ8.0CA  [DIOM4336X265N]  53.34,144.78 0 top
D168  SMBJ8.0CA  [DIOM4336X265N]  53.34,140.34 0 top
D169  SMBJ8.0CA  [DIOM4336X265N]  53.34,135.89 0 top
D170  SMBJ8.0CA  [DIOM4336X265N]  53.34,131.44 0 top
D171  SMBJ8.0CA  [DIOM4336X265N]  123.83,184.15 270 top
D172  SMBJ8.0CA  [DIOM4336X265N]  45.72,144.78 0 top
D173  SMBJ8.0CA  [DIOM4336X265N]  45.72,140.34 0 top
D174  SMBJ8.0CA  [DIOM4336X265N]  45.72,135.89 0 top
D175  SMBJ8.0CA  [DIOM4336X265N]  45.72,131.44 0 top
D176  SMBJ8.0CA  [DIOM4336X265N]  38.1,144.78 0 top
D177  SMBJ8.0CA  [DIOM4336X265N]  38.1,140.34 0 top
D178  SMBJ8.0CA  [DIOM4336X265N]  38.1,135.89 0 top
D179  SMBJ8.0CA  [DIOM4336X265N]  38.1,131.44 0 top
D180  SMBJ8.0CA  [DIOM4336X265N]  30.48,144.78 0 top
D181  SMBJ8.0CA  [DIOM4336X265N]  30.48,140.34 0 top
D182  SMBJ8.0CA  [DIOM4336X265N]  30.48,135.89 0 top
D183  SMBJ8.0CA  [DIOM4336X265N]  30.48,131.44 0 top
D184  SMBJ8.0CA  [DIOM4336X265N]  22.86,144.78 0 top
D185  SMBJ8.0CA  [DIOM4336X265N]  22.86,140.34 0 top
D186  SMBJ8.0CA  [DIOM4336X265N]  22.86,135.89 0 top
D187  SMBJ8.0CA  [DIOM4336X265N]  22.86,131.44 0 top
D188  SMBJ8.0CA  [DIOM4336X265N]  15.24,144.78 0 top
D189  SMBJ8.0CA  [DIOM4336X265N]  15.24,140.34 0 top
D190  SMBJ8.0CA  [DIOM4336X265N]  15.24,135.89 0 top
D191  SMBJ8.0CA  [DIOM4336X265N]  15.24,131.44 0 top
D192  SMBJ8.0CA  [DIOM4336X265N]  7.62,144.78 0 top
D193  SMBJ8.0CA  [DIOM4336X265N]  7.62,140.34 0 top
D194  SMBJ8.0CA  [DIOM4336X265N]  7.62,135.89 0 top
D195  SMBJ8.0CA  [DIOM4336X265N]  7.62,131.44 0 top
D196  SMBJ8.0CA  [DIOM4336X265N]  118.75,184.15 270 top
D197  SMBJ8.0CA  [DIOM4336X265N]  102.23,184.15 270 top
D198  D_B5819W-SL_CHANGJ_SOD123  [SOD123]  27.3,41.91 270 top
D199  [LED-0603]  152.4,100.33 270 top
D200  [LED-0603]  154.94,100.33 270 top
D201  [LED-0603]  144.78,100.33 270 top
D202  [LED-0603]  147.32,100.33 270 top
D203  [LED-0603]  137.16,100.33 270 top
D204  [LED-0603]  139.7,100.33 270 top
D205  [LED-0603]  129.54,100.33 270 top
D206  [LED-0603]  132.08,100.33 270 top
D207  [LED-0603]  121.92,100.33 270 top
D208  [LED-0603]  124.46,100.33 270 top
D209  [LED-0603]  114.3,100.33 270 top
D210  [LED-0603]  116.84,100.33 270 top
D211  [LED-0603]  106.68,100.33 270 top
D212  [LED-0603]  109.22,100.33 270 top
D213  [LED-0603]  99.06,100.33 270 top
D214  [LED-0603]  101.6,100.33 270 top
D215  [LED-0603]  91.44,100.33 270 top
D216  [LED-0603]  93.98,100.33 270 top
D217  [LED-0603]  83.82,100.33 270 top
D218  [LED-0603]  86.36,100.33 270 top
D219  [LED-0603]  76.2,100.33 270 top
D220  [LED-0603]  78.74,100.33 270 top
D221  [LED-0603]  68.58,100.33 270 top
D222  [LED-0603]  71.12,100.33 270 top
D223  [LED-0603]  60.96,100.33 270 top
D224  [LED-0603]  63.5,100.33 270 top
D225  [LED-0603]  53.34,100.33 270 top
D226  [LED-0603]  55.88,100.33 270 top
D227  [LED-0603]  45.72,100.33 270 top
D228  [LED-0603]  48.26,100.33 270 top
D229  [LED-0603]  38.1,100.33 270 top
D230  [LED-0603]  40.64,100.33 270 top
D231  [LED-0603]  31.11,100.33 270 top
D232  [LED-0603]  33.66,100.33 270 top
D233  [LED-0603]  22.86,100.33 270 top
D234  [LED-0603]  25.4,100.33 270 top
D235  [LED-0603]  15.88,100.33 270 top
D236  [LED-0603]  18.41,100.33 270 top
D237  [LED-0603]  7.62,100.33 270 top
D238  [LED-0603]  10.16,100.33 270 top
ESTOP  B2B-PH-K  [B2B-PH-K]  130.18,184.78 0 top
ESTOP_2  [1X02]  140.34,184.15 90 top
F1  MF-MSMF-STYLE2_1  [FUSC4632X160]  142.24,14.61 180 top
F2  MF-MSMF-STYLE2_1  [FUSC4632X160]  142.24,19.68 180 top
GAME_INTERFACE  B12B-PH-K  [B12B-PH-K]  85.72,184.78 0 top
H1  MOUNT-HOLE3.0  [3,0]  154.94,5.08 0 top
H2  MOUNT-HOLE3.0  [3,0]  154.94,184.15 0 top
H3  MOUNT-HOLE3.0  [3,0]  5.08,184.15 0 top
H4  MOUNT-HOLE3.0  [3,0]  5.08,5.08 0 top
I2C  [1X04]  9.53,36.83 180 top
IC1  MAX481CSA  [SO08]  151.13,175.26 180 top
IC2  LD117AS12TR  [SOT223]  99.06,10.16 90 top
IC3  MAX481CSA  [SO08]  143.51,175.26 180 top
IC4  MAX481CSA  [SO08]  135.89,175.26 180 top
IC5  MAX481CSA  [SO08]  128.27,175.26 180 top
IC6  MAX481CSA  [SO08]  120.65,175.26 180 top
IC7  MAX481CSA  [SO08]  113.03,175.26 180 top
IC8  MAX481CSA  [SO08]  105.41,175.26 180 top
IC9  MAX481CSA  [SO08]  97.79,175.26 180 top
IC10  MAX481CSA  [SO08]  90.17,175.26 180 top
IC11  MAX481CSA  [SO08]  82.55,175.26 180 top
IC12  MAX481CSA  [SO08]  74.93,175.26 180 top
IC13  MAX481CSA  [SO08]  67.31,175.26 180 top
IC14  MAX481CSA  [SO08]  59.69,175.26 180 top
IC15  MAX481CSA  [SO08]  52.07,175.26 180 top
IC16  MAX481CSA  [SO08]  44.45,175.26 180 top
IC17  MAX481CSA  [SO08]  36.83,175.26 180 top
IC18  MAX481CSA  [SO08]  29.21,175.26 180 top
IC19  MAX481CSA  [SO08]  21.59,175.26 180 top
IC20  MAX481CSA  [SO08]  13.97,175.26 180 top
IC21  MAX481CSA  [SO08]  6.35,175.26 180 top
IC22  LD117AS12TR  [SOT223]  109.22,10.16 90 top
J1  [2X5-SHROUDED]  12.7,70.48 90 top
JP1  [1X03]  28.57,21.59 0 top
JP2  [1X04]  9.53,44.45 0 top
JP3  [2X02]  67.94,184.78 0 top
JP4  [2X02]  141.6,8.26 0 top
JTAG  [1X05]  10.79,52.07 0 top
MIDI_IN  B4B-PH-K  [B4B-PH-K]  57.78,184.78 0 top
NEBULA_A  MCP23017-E/SO  [SOIC127P1030X265-28N]  139.06,87.63 0 top
NEBULA_B  MCP23017-E/SO  [SOIC127P1030X265-28N]  106.05,87.63 0 top
NEBULA_C  MCP23017-E/SO  [SOIC127P1030X265-28N]  89.53,87.63 0 top
NEBULA_D  MCP23017-E/SO  [SOIC127P1030X265-28N]  56.52,87.63 0 top
NEBULA_E  MCP23017-E/SO  [SOIC127P1030X265-28N]  23.5,87.63 0 top
NEBULA_F  MCP23017-E/SO  [SOIC127P1030X265-28N]  122.56,87.63 0 top
NEBULA_G  MCP23017-E/SO  [SOIC127P1030X265-28N]  73.03,87.63 0 top
NEBULA_H  MCP23017-E/SO  [SOIC127P1030X265-28N]  40.01,87.63 0 top
POWER_IN  MKDSN1,5/4-5,08  [MKDSN1,5/4-5,08]  153.03,22.23 270 top
R1  120  [R0603]  154.94,170.81 270 top
R2  120  [R0603]  147.32,170.81 270 top
R3  1k  [R0603]  152.4,116.2 270 top
R4  1k  [R0603]  152.4,120.02 270 top
R5  1k  [R0603]  152.4,123.83 270 top
R6  1k  [R0603]  152.4,127.64 270 top
R7  1k  [R0603]  144.78,116.2 270 top
R8  1k  [R0603]  144.78,120.02 270 top
R9  1k  [R0603]  144.78,123.83 270 top
R10  1k  [R0603]  144.78,127.64 270 top
R11  1k  [R0603]  137.16,116.2 270 top
R12  1k  [R0603]  137.16,120.02 270 top
R13  1k  [R0603]  137.16,123.83 270 top
R14  1k  [R0603]  137.16,127.64 270 top
R15  1k  [R0603]  129.54,116.2 270 top
R16  1k  [R0603]  129.54,120.02 270 top
R17  1k  [R0603]  129.54,123.83 270 top
R18  1k  [R0603]  129.54,127.64 270 top
R19  1k  [R0603]  121.92,116.2 270 top
R20  1k  [R0603]  121.92,120.02 270 top
R21  1k  [R0603]  121.92,123.83 270 top
R22  1k  [R0603]  121.92,127.64 270 top
R23  1k  [R0603]  114.3,116.2 270 top
R24  1k  [R0603]  114.3,120.02 270 top
R25  1k  [R0603]  114.3,123.83 270 top
R26  R_2K_0603  [R0603]  72.39,11.43 90 top
R27  R_2K_0603  [R0603]  80.01,11.43 90 top
R28  1k  [R0603]  114.3,127.64 270 top
R29  1k  [R0603]  106.68,116.2 270 top
R30  1k  [R0603]  106.68,120.02 270 top
R31  1k  [R0603]  106.68,123.83 270 top
R32  1k  [R0603]  106.68,127.64 270 top
R33  1k  [R0603]  99.06,116.2 270 top
R34  1k  [R0603]  99.06,120.02 270 top
R35  1k  [R0603]  99.06,123.83 270 top
R36  1k  [R0603]  99.06,127.64 270 top
R37  1k  [R0603]  91.44,116.2 270 top
R38  1k  [R0603]  91.44,120.02 270 top
R39  1k  [R0603]  91.44,123.83 270 top
R40  1k  [R0603]  91.44,127.64 270 top
R41  1k  [R0603]  83.82,116.2 270 top
R42  1k  [R0603]  83.82,120.02 270 top
R43  1k  [R0603]  83.82,123.83 270 top
R44  1k  [R0603]  83.82,127.64 270 top
R45  1k  [R0603]  76.2,116.2 270 top
R46  1k  [R0603]  76.2,120.02 270 top
R47  1k  [R0603]  76.2,123.83 270 top
R48  1k  [R0603]  76.2,127.64 270 top
R49  1k  [R0603]  68.58,116.2 270 top
R50  1k  [R0603]  68.58,120.02 270 top
R51  1k  [R0603]  68.58,123.83 270 top
R52  1k  [R0603]  68.58,127.64 270 top
R53  1k  [R0603]  60.96,116.2 270 top
R54  68  [R0603]  154.94,167 270 top
R55  68  [R0603]  147.32,167 270 top
R56  68  [R0603]  139.7,167 270 top
R57  68  [R0603]  132.08,167 270 top
R58  68  [R0603]  124.46,167 270 top
R59  68  [R0603]  116.84,167 270 top
R60  68  [R0603]  109.22,167 270 top
R61  68  [R0603]  101.6,167 270 top
R62  68  [R0603]  93.98,167 270 top
R63  68  [R0603]  86.36,167 270 top
R64  68  [R0603]  78.74,167 270 top
R65  68  [R0603]  71.12,167 270 top
R66  1k  [R0603]  60.96,120.02 270 top
R67  10k  [R0603]  135.89,184.15 90 top
R68  10  [R1206]  147.32,184.15 270 top
R69  1k  [R0603]  60.96,123.83 270 top
R70  1k  [R0603]  60.96,127.64 270 top
R71  1k  [R0603]  53.34,116.2 270 top
R72  1k  [R0603]  53.34,120.02 270 top
R73  1k  [R0603]  53.34,123.83 270 top
R74  1k  [R0603]  53.34,127.64 270 top
R75  1k  [R0603]  45.72,116.2 270 top
R76  1k  [R0603]  45.72,120.02 270 top
R77  1k  [R0603]  45.72,123.83 270 top
R78  1k  [R0603]  45.72,127.64 270 top
R79  1k  [R0603]  38.1,116.2 270 top
R80  1k  [R0603]  38.1,120.02 270 top
R81  1k  [R0603]  38.1,123.83 270 top
R82  1k  [R0603]  38.1,127.64 270 top
R83  68  [R0603]  63.5,167 270 top
R84  68  [R0603]  55.88,167 270 top
R85  68  [R0603]  48.26,167 270 top
R86  68  [R0603]  40.64,167 270 top
R87  1k  [R0603]  30.48,116.2 270 top
R88  1k  [R0603]  30.48,120.02 270 top
R89  1k  [R0603]  30.48,123.83 270 top
R90  1k  [R0603]  30.48,127.64 270 top
R91  1k  [R0603]  22.86,116.2 270 top
R92  1k  [R0603]  22.86,120.02 270 top
R93  1k  [R0603]  22.86,123.83 270 top
R94  1k  [R0603]  22.86,127.64 270 top
R95  1k  [R0603]  15.24,116.2 270 top
R96  1k  [R0603]  15.24,120.02 270 top
R97  1k  [R0603]  15.24,123.83 270 top
R98  1k  [R0603]  15.24,127.64 270 top
R99  1k  [R0603]  7.62,116.2 270 top
R100  1k  [R0603]  7.62,120.02 270 top
R101  1k  [R0603]  7.62,123.83 270 top
R102  1k  [R0603]  7.62,127.64 270 top
R103  68  [R0603]  33.02,167 270 top
R104  68  [R0603]  25.4,167 270 top
R105  68  [R0603]  17.78,167 270 top
R106  68  [R0603]  10.16,167 270 top
R107  120  [R0603]  139.7,170.81 270 top
R108  120  [R0603]  132.08,170.81 270 top
R109  120  [R0603]  124.46,170.81 270 top
R110  120  [R0603]  116.84,170.81 270 top
R111  120  [R0603]  109.22,170.81 270 top
R112  120  [R0603]  101.6,170.81 270 top
R113  120  [R0603]  93.98,170.81 270 top
R114  120  [R0603]  86.36,170.81 270 top
R115  120  [R0603]  78.74,170.81 270 top
R116  120  [R0603]  71.12,170.81 270 top
R117  120  [R0603]  63.5,170.81 270 top
R118  120  [R0603]  55.88,170.81 270 top
R119  120  [R0603]  48.26,170.81 270 top
R120  120  [R0603]  40.64,170.81 270 top
R121  120  [R0603]  33.02,170.81 270 top
R122  120  [R0603]  25.4,170.81 270 top
R123  120  [R0603]  17.78,170.81 270 top
R124  120  [R0603]  10.16,170.81 270 top
R125  1k  [R0603]  54.61,61.59 0 top
R126  1k  [R0603]  63.5,61.59 0 top
R127  1k  [R0603]  54.61,56.52 0 top
R128  1k  [R0603]  63.5,56.52 0 top
R129  1k  [R0603]  45.72,61.59 0 top
R130  1k  [R0603]  16.51,9.53 180 top
R131  2.2k  [R0603]  16.51,6.99 180 top
R132  R_1K_0603  [R0603]  16.51,4.45 180 top
R133  10k  [R0603]  77.47,66.67 0 top
R134  10k  [R0603]  97.79,53.98 0 top
R135  10k  [R0603]  87.63,53.98 0 top
R136  10k  [R0603]  97.79,66.67 0 top
R137  10k  [R0603]  87.63,66.67 0 top
R138  10  [R1206]  144.15,184.15 270 top
R139  1k  [R0603]  16.51,1.91 180 top
R140  68  [R0603]  154.94,156.84 90 top
R141  68  [R0603]  154.94,153.03 90 top
R142  68  [R0603]  154.94,149.22 90 top
R143  68  [R0603]  152.4,149.22 90 top
R144  68  [R0603]  147.32,156.84 90 top
R145  68  [R0603]  147.32,153.03 90 top
R146  68  [R0603]  147.32,149.22 90 top
R147  68  [R0603]  144.78,149.22 90 top
R148  68  [R0603]  139.7,156.84 90 top
R149  68  [R0603]  139.7,153.03 90 top
R150  68  [R0603]  139.7,149.22 90 top
R151  68  [R0603]  137.16,149.22 90 top
R152  68  [R0603]  132.08,156.84 90 top
R153  68  [R0603]  132.08,153.03 90 top
R154  68  [R0603]  132.08,149.22 90 top
R155  68  [R0603]  129.54,149.22 90 top
R156  68  [R0603]  124.46,156.84 90 top
R157  68  [R0603]  124.46,153.03 90 top
R158  68  [R0603]  124.46,149.22 90 top
R159  68  [R0603]  121.92,149.22 90 top
R160  68  [R0603]  116.84,156.84 90 top
R161  68  [R0603]  116.84,153.03 90 top
R162  68  [R0603]  116.84,149.22 90 top
R163  68  [R0603]  114.3,149.22 90 top
R164  68  [R0603]  109.22,156.84 90 top
R165  68  [R0603]  109.22,153.03 90 top
R166  68  [R0603]  109.22,149.22 90 top
R167  68  [R0603]  106.68,149.22 90 top
R168  68  [R0603]  101.6,156.84 90 top
R169  68  [R0603]  101.6,153.03 90 top
R170  68  [R0603]  101.6,149.22 90 top
R171  68  [R0603]  99.06,149.22 90 top
R172  68  [R0603]  93.98,156.84 90 top
R173  68  [R0603]  93.98,153.03 90 top
R174  68  [R0603]  93.98,149.22 90 top
R175  68  [R0603]  91.44,149.22 90 top
R176  68  [R0603]  86.36,156.84 90 top
R177  68  [R0603]  86.36,153.03 90 top
R178  68  [R0603]  86.36,149.22 90 top
R179  68  [R0603]  83.82,149.22 90 top
R180  68  [R0603]  78.74,156.84 90 top
R181  68  [R0603]  78.74,153.03 90 top
R182  68  [R0603]  78.74,149.22 90 top
R183  68  [R0603]  76.2,149.22 90 top
R184  68  [R0603]  71.12,156.84 90 top
R185  68  [R0603]  71.12,153.03 90 top
R186  68  [R0603]  71.12,149.22 90 top
R187  68  [R0603]  68.58,149.22 90 top
R188  68  [R0603]  63.5,156.84 90 top
R189  68  [R0603]  63.5,153.03 90 top
R190  68  [R0603]  63.5,149.22 90 top
R191  68  [R0603]  60.96,149.22 90 top
R192  68  [R0603]  48.26,156.84 90 top
R193  68  [R0603]  55.88,156.84 90 top
R194  68  [R0603]  55.88,153.03 90 top
R195  68  [R0603]  55.88,149.22 90 top
R196  68  [R0603]  53.34,149.22 90 top
R197  68  [R0603]  48.26,153.03 90 top
R198  68  [R0603]  48.26,149.22 90 top
R199  68  [R0603]  45.72,149.22 90 top
R200  68  [R0603]  40.64,156.84 90 top
R201  68  [R0603]  40.64,153.03 90 top
R202  68  [R0603]  40.64,149.22 90 top
R203  68  [R0603]  38.1,149.22 90 top
R204  68  [R0603]  33.02,156.84 90 top
R205  68  [R0603]  33.02,153.03 90 top
R206  68  [R0603]  33.02,149.22 90 top
R207  68  [R0603]  30.48,149.22 90 top
R208  68  [R0603]  25.4,156.84 90 top
R209  68  [R0603]  25.4,153.03 90 top
R210  68  [R0603]  25.4,149.22 90 top
R211  68  [R0603]  22.86,149.22 90 top
R212  68  [R0603]  17.78,156.84 90 top
R213  68  [R0603]  17.78,153.03 90 top
R214  68  [R0603]  17.78,149.22 90 top
R215  68  [R0603]  15.24,149.22 90 top
R216  68  [R0603]  10.16,156.84 90 top
R217  68  [R0603]  10.16,153.03 90 top
R218  68  [R0603]  10.16,149.22 90 top
R219  68  [R0603]  7.62,149.22 90 top
R220  R_270R_0603  [R0603]  83.82,64.14 0 top
R221  R_56R_0603  [R0603]  93.98,64.14 0 top
R222  R_56R_0603  [R0603]  83.82,51.44 0 top
R223  R_270R_0603  [R0603]  93.98,51.44 0 top
R224  R_82R_0603  [R0603]  73.66,64.14 0 top
R225  R_1K_0603  [R0603]  16.51,12.06 180 top
R226  68  [R0603]  154.94,111.76 90 top
R227  68  [R0603]  152.4,111.76 90 top
R228  68  [R0603]  154.94,107.95 90 top
R229  68  [R0603]  152.4,107.95 90 top
R230  68  [R0603]  147.32,111.76 90 top
R231  68  [R0603]  144.78,111.76 90 top
R232  68  [R0603]  147.32,107.95 90 top
R233  68  [R0603]  144.78,107.95 90 top
R234  68  [R0603]  137.16,107.95 90 top
R235  68  [R0603]  139.7,107.95 90 top
R236  68  [R0603]  137.16,111.76 90 top
R237  68  [R0603]  139.7,111.76 90 top
R238  68  [R0603]  129.54,111.76 90 top
R239  68  [R0603]  132.08,111.76 90 top
R240  68  [R0603]  132.08,107.95 90 top
R241  68  [R0603]  129.54,107.95 90 top
R242  68  [R0603]  121.92,107.95 90 top
R243  68  [R0603]  121.92,111.76 90 top
R244  68  [R0603]  124.46,107.95 90 top
R245  68  [R0603]  124.46,111.76 90 top
R246  68  [R0603]  114.3,107.95 90 top
R247  68  [R0603]  114.3,111.76 90 top
R248  68  [R0603]  116.84,107.95 90 top
R249  68  [R0603]  116.84,111.76 90 top
R250  68  [R0603]  106.68,107.95 90 top
R251  68  [R0603]  106.68,111.76 90 top
R252  68  [R0603]  109.22,107.95 90 top
R253  68  [R0603]  109.22,111.76 90 top
R254  68  [R0603]  99.06,107.95 90 top
R255  68  [R0603]  99.06,111.76 90 top
R256  68  [R0603]  101.6,107.95 90 top
R257  68  [R0603]  101.6,111.76 90 top
R258  68  [R0603]  91.44,107.95 90 top
R259  68  [R0603]  91.44,111.76 90 top
R260  68  [R0603]  93.98,107.95 90 top
R261  68  [R0603]  93.98,111.76 90 top
R262  68  [R0603]  83.82,107.95 90 top
R263  68  [R0603]  83.82,111.76 90 top
R264  68  [R0603]  86.36,107.95 90 top
R265  68  [R0603]  86.36,111.76 90 top
R266  68  [R0603]  76.2,107.95 90 top
R267  68  [R0603]  76.2,111.76 90 top
R268  68  [R0603]  78.74,107.95 90 top
R269  68  [R0603]  78.74,111.76 90 top
R270  68  [R0603]  68.58,107.95 90 top
R271  68  [R0603]  68.58,111.76 90 top
R272  68  [R0603]  71.12,107.95 90 top
R273  68  [R0603]  71.12,111.76 90 top
R274  68  [R0603]  60.96,107.95 90 top
R275  68  [R0603]  60.96,111.76 90 top
R276  68  [R0603]  63.5,107.95 90 top
R277  68  [R0603]  63.5,111.76 90 top
R278  68  [R0603]  53.34,107.95 90 top
R279  68  [R0603]  53.34,111.76 90 top
R280  68  [R0603]  55.88,107.95 90 top
R281  68  [R0603]  55.88,111.76 90 top
R282  68  [R0603]  45.72,107.95 90 top
R283  68  [R0603]  45.72,111.76 90 top
R284  68  [R0603]  48.26,107.95 90 top
R285  68  [R0603]  48.26,111.76 90 top
R286  68  [R0603]  38.1,107.95 90 top
R287  68  [R0603]  38.1,111.76 90 top
R288  68  [R0603]  40.64,107.95 90 top
R289  68  [R0603]  40.64,111.76 90 top
R290  68  [R0603]  31.11,107.95 90 top
R291  68  [R0603]  31.11,111.76 90 top
R292  68  [R0603]  33.66,107.95 90 top
R293  68  [R0603]  33.66,111.76 90 top
R294  68  [R0603]  25.4,111.76 90 top
R295  68  [R0603]  25.4,107.95 90 top
R296  68  [R0603]  22.86,111.76 90 top
R297  68  [R0603]  22.86,107.95 90 top
R298  68  [R0603]  15.88,107.95 90 top
R299  68  [R0603]  15.88,111.76 90 top
R300  68  [R0603]  18.41,107.95 90 top
R301  68  [R0603]  18.41,111.76 90 top
R302  68  [R0603]  7.62,107.95 90 top
R303  68  [R0603]  7.62,111.76 90 top
R304  68  [R0603]  10.16,107.95 90 top
R305  68  [R0603]  10.16,111.76 90 top
R306  R_220R_0603  [R0603]  23.5,40.64 0 top
R307  R_220R_0603  [R0603]  44.45,40.64 0 top
R308  1k  [R0603]  152.4,104.14 270 top
R309  1k  [R0603]  154.94,104.14 270 top
R310  R_1K_0603  [R0603]  69.85,11.43 270 top
R311  1k  [R0603]  144.78,104.14 270 top
R312  1k  [R0603]  147.32,104.14 270 top
R313  1k  [R0603]  137.16,104.14 270 top
R314  1k  [R0603]  139.7,104.14 270 top
R315  1k  [R0603]  129.54,104.14 270 top
R316  1k  [R0603]  132.08,104.14 270 top
R317  1k  [R0603]  121.92,104.14 270 top
R318  1k  [R0603]  124.46,104.14 270 top
R319  1k  [R0603]  114.3,104.14 270 top
R320  1k  [R0603]  116.84,104.14 270 top
R321  1k  [R0603]  106.68,104.14 270 top
R322  1k  [R0603]  109.22,104.14 270 top
R323  1k  [R0603]  99.06,104.14 270 top
R324  1k  [R0603]  101.6,104.14 270 top
R325  1k  [R0603]  91.44,104.14 270 top
R326  1k  [R0603]  93.98,104.14 270 top
R327  1k  [R0603]  83.82,104.14 270 top
R328  1k  [R0603]  86.36,104.14 270 top
R329  1k  [R0603]  76.2,104.14 270 top
R330  1k  [R0603]  78.74,104.14 270 top
R331  1k  [R0603]  68.58,104.14 270 top
R332  1k  [R0603]  71.12,104.14 270 top
R333  1k  [R0603]  60.96,104.14 270 top
R334  1k  [R0603]  63.5,104.14 270 top
R335  1k  [R0603]  53.34,104.14 270 top
R336  1k  [R0603]  55.88,104.14 270 top
R337  1k  [R0603]  45.72,104.14 270 top
R338  1k  [R0603]  48.26,104.14 270 top
R339  1k  [R0603]  38.1,104.14 270 top
R340  1k  [R0603]  40.64,104.14 270 top
R341  1k  [R0603]  31.11,104.14 270 top
R342  1k  [R0603]  33.66,104.14 270 top
R343  1k  [R0603]  22.86,104.14 270 top
R344  1k  [R0603]  25.4,104.14 270 top
R345  1k  [R0603]  15.88,104.14 270 top
R346  1k  [R0603]  18.41,104.14 270 top
R347  1k  [R0603]  7.62,104.14 270 top
R348  1k  [R0603]  10.16,104.14 270 top
S1  MOMENTARY-SWITCH-SPST-PTH-6.0MM  [TACTILE_SWITCH_PTH_6.0MM]  87.63,59.05 0 top
S2  MOMENTARY-SWITCH-SPST-PTH-6.0MM  [TACTILE_SWITCH_PTH_6.0MM]  97.79,59.05 0 top
S3  MOMENTARY-SWITCH-SPST-PTH-6.0MM  [TACTILE_SWITCH_PTH_6.0MM]  87.63,46.35 0 top
S4  MOMENTARY-SWITCH-SPST-PTH-6.0MM  [TACTILE_SWITCH_PTH_6.0MM]  97.79,46.35 0 top
S5  MOMENTARY-SWITCH-SPST-PTH-6.0MM  [TACTILE_SWITCH_PTH_6.0MM]  77.47,59.05 0 top
STAR_1  B8B-PH-K  [B8B-PH-K]  150.5,161.29 90 top
STAR_2  B8B-PH-K  [B8B-PH-K]  142.88,161.29 90 top
STAR_3  B8B-PH-K  [B8B-PH-K]  135.25,161.29 90 top
STAR_4  B8B-PH-K  [B8B-PH-K]  127.64,161.29 90 top
STAR_5  B8B-PH-K  [B8B-PH-K]  120.02,161.29 90 top
STAR_6  B8B-PH-K  [B8B-PH-K]  112.39,161.29 90 top
STAR_7  B8B-PH-K  [B8B-PH-K]  104.78,161.29 90 top
STAR_8  B8B-PH-K  [B8B-PH-K]  97.16,161.29 90 top
STAR_9  B8B-PH-K  [B8B-PH-K]  89.53,161.29 90 top
STAR_10  B8B-PH-K  [B8B-PH-K]  81.92,161.29 90 top
STAR_11  B8B-PH-K  [B8B-PH-K]  74.3,161.29 90 top
STAR_12  B8B-PH-K  [B8B-PH-K]  66.67,161.29 90 top
STAR_13  B8B-PH-K  [B8B-PH-K]  59.05,161.29 90 top
STAR_14  B8B-PH-K  [B8B-PH-K]  51.44,161.29 90 top
STAR_15  B8B-PH-K  [B8B-PH-K]  43.81,161.29 90 top
STAR_16  B8B-PH-K  [B8B-PH-K]  36.2,161.29 90 top
STAR_17  B8B-PH-K  [B8B-PH-K]  28.57,161.29 90 top
STAR_18  B8B-PH-K  [B8B-PH-K]  20.95,161.29 90 top
STAR_19  B8B-PH-K  [B8B-PH-K]  13.34,161.29 90 top
STAR_20  B8B-PH-K  [B8B-PH-K]  5.71,161.29 90 top
U1  6N138SDM  [COUPL_6N138SDM]  35.56,41.91 0 top
U$1  ESP32DEVKITV1  [ESP32-DEVKITV1]  69.85,17.14 0 top
ULN2  [SO18L]  34.92,63.5 270 top

## Tracks (layer width: path | path; a pad name or v marks a point on that pad's centre or on a via)
2  (via drill 0.35)
  Top 0.305: v16.03,39.69 16.03,39.53 32.38,23.18 32.38,15.72 46.35,1.75 51.91,1.75 53.66,3.49 54.45,3.49 U$1.4
  Bottom 0.305: v16.03,39.69 13.02,39.69 JP2.2
4  (via drill 0.35)
  Top 0.305: 116.68,182.09 113.82,182.09 111.6,184.31 111.6,184.78 APA102.3 | 116.68,182.09 118.75,182.09 D196.2 | v72.87,15.88 67.79,15.88 57.15,5.24 57.15,3.65 U$1.5 | v119.38,175.26 119.38,175.74 116.68,178.44 116.68,182.09
  $GND 0.305: v123.35,169.07 123.35,171.29 v119.38,175.26
  Bottom 0.305: v72.87,15.88 99.85,15.88 127.16,43.18 127.16,107.63 123.83,110.97 123.83,125.09 123.67,125.25 123.67,168.75 v123.35,169.07
5  (via drill 0.35)
  Top 0.305: v44.93,4.76 44.93,11.43 16.83,39.53 16.83,40.01 v16.03,40.8
  Bottom 0.305: v44.93,4.76 45.09,4.92 62.55,4.92 63.82,3.65 64.61,3.65 U$1.8 | v16.03,40.8 14.45,40.8 JP2.3
12  (via drill 0.35)
  Top 0.305: v38.58,43.66 36.2,43.66 29.05,50.8 v26.35,50.8
  Bottom 0.305: v38.58,43.66 53.82,28.42 54.45,28.42 U$1.27 | v26.35,50.8 19.68,50.8 16.35,54.13 10.32,54.13 JTAG.2
13  (via drill 0.35)
  Top 0.508: v24.29,9.37 24.29,5.71 21.27,2.7 21.27,1.91 D94.A | v20.32,10.95 21.11,11.75 21.11,12.06 C125.2 21.11,12.22 20.16,13.18 18.57,13.18 | 18.57,13.18 17.46,12.06 R225.1 | JTAG.3 10.79,49.69 15.08,45.4 15.08,31.11 14.61,30.64 14.61,17.14 18.57,13.18
  Bottom 0.508: v20.32,10.95 21.91,9.37 v24.29,9.37 24.45,9.53 33.5,9.53 51.91,27.94 51.91,28.26 U$1.28
14
  SIGNAL3 0.305: JTAG.4 14.61,53.34 19.53,53.34 21.59,55.4 35.4,55.4 36.04,54.77 36.04,51.91 56.99,30.96 56.99,28.42 U$1.26
15
  Top 0.305: JTAG.5 15.88,44.93 25.08,35.72 25.08,32.07 45.72,11.43 45.72,3.17 46.51,2.38 50.01,2.38 51.12,3.49 51.91,3.49 U$1.3
16/RX2  (via drill 0.35)
  Top 0.305: v28.57,7.46 JP1.2
  Top 0.406: v9.53,177.8 8.79,177.8 IC21.1 | v17.14,177.8 16.41,177.8 IC20.1 | v24.77,177.8 24.03,177.8 IC19.1 | v32.38,177.8 31.65,177.8 IC18.1 | v40.01,177.8 39.27,177.8 IC17.1 | v47.62,177.8 46.89,177.8 IC16.1 | v55.24,177.8 54.51,177.8 IC15.1 | v62.87,177.8 62.13,177.8 IC14.1 | v70.48,177.8 69.75,177.8 IC13.1 | v78.11,177.8 77.37,177.8 IC12.1 | v85.72,177.8 84.99,177.8 IC11.1 | v93.34,177.8 92.61,177.8 IC10.1 | v100.97,177.8 100.23,177.8 IC9.1 | v108.58,177.8 107.85,177.8 IC8.1 | v116.2,177.8 115.47,177.8 IC7.1 | v123.83,177.8 123.09,177.8 IC6.1 | v131.44,177.8 130.71,177.8 IC5.1 | v139.06,177.8 138.33,177.8 IC4.1 | v146.69,177.8 145.95,177.8 IC3.1 145.41,180.34 146.05,180.97 151.76,180.97 153.03,179.71 IC1.1
  SIGNAL3 0.305: v28.57,7.46 28.57,7.62
  SIGNAL3 0.406: U$1.6 55.66,7.62 28.57,7.62 11.09,7.62 1.93,16.78 1.93,177.19 2.54,177.8 v9.53,177.8 v17.14,177.8 v24.77,177.8 v32.38,177.8 v40.01,177.8 v47.62,177.8 v55.24,177.8 v62.87,177.8 v70.48,177.8 v78.11,177.8 v85.72,177.8 v93.34,177.8 v100.97,177.8 v108.58,177.8 v116.2,177.8 v123.83,177.8 v131.44,177.8 v139.06,177.8 v146.69,177.8
17/TX2  (via drill 0.35)
  Top 0.305: v18.41,179.71 19.68,178.44 IC19.4 | v31.11,2.54 JP1.3
  Top 0.406: v3.17,179.71 4.45,178.44 IC21.4 | v10.79,179.71 12.06,178.44 IC20.4 | v26.04,179.71 27.3,178.44 IC18.4 | v33.66,179.71 34.92,178.44 IC17.4 | v41.27,179.71 42.55,178.44 IC16.4 | v48.9,179.71 50.16,178.44 IC15.4 | v56.52,179.71 57.78,178.44 IC14.4 | v64.14,179.71 65.41,178.44 IC13.4 | v71.75,179.71 73.03,178.44 IC12.4 | v79.38,179.71 80.64,178.44 IC11.4 | v87,179.71 88.27,178.44 IC10.4 | v94.61,179.71 95.89,178.44 IC9.4 | v102.23,179.71 103.5,178.44 IC8.4 | v109.86,179.71 111.12,178.44 IC7.4 | v117.47,179.71 118.75,178.44 IC6.4 | v125.09,179.71 126.36,178.44 IC5.4 | v132.72,179.71 133.99,178.44 IC4.4 | v140.34,179.71 141.6,178.44 IC3.4 | v147.96,179.71 149.22,178.44 IC1.4
  SIGNAL3 0.305: v31.11,2.54 31.11,2.39
  SIGNAL3 0.406: U$1.7 61.39,3.6 60.18,2.39 31.11,2.39 15.39,2.39 1.27,16.51 1.27,178.44 2.54,179.71 v3.17,179.71 v10.79,179.71 v18.41,179.71 v26.04,179.71 v33.66,179.71 v41.27,179.71 v48.9,179.71 v56.52,179.71 v64.14,179.71 v71.75,179.71 v79.38,179.71 v87,179.71 v94.61,179.71 v102.23,179.71 v109.86,179.71 v117.47,179.71 v125.09,179.71 v132.72,179.71 v140.34,179.71 v147.96,179.71
18  (via drill 0.35)
  Top 0.508: D197.2 102.5,182.25 109.22,182.25 109.49,182.51 APA102.2
  SIGNAL3 0.305: v129.86,137.79 129.86,175.74 128.75,176.85 119.7,176.85 v119.54,176.69
  Bottom 0.305: 134.78,49.85 134.7,49.77 | 134.7,49.77 87.31,2.38 79.53,2.38 78.74,3.17 78.74,3.97 77.79,4.92 69.37,4.92 68.1,3.65 67.31,3.65 U$1.9 | v129.86,137.79 129.54,137.48 129.54,92.23 128.11,90.81 128.11,56.36 134.7,49.77 | v119.54,176.69 118.43,176.69 112.24,182.88 110.97,182.88 109.54,184.31 109.54,184.78 APA102.2
19  (via drill 0.35)
  Top 0.305: U$1.10 69.85,3.65 R310.2 R310.1 69.85,12.38 v67.63,14.61 | 43.02,40.64 U1.6 38.42,40.64 29.05,50.01 26.04,50.01 7.62,68.42 J1.1 | 43.02,40.64 R307.1 | 43.02,40.64 v44.29,39.37
  Bottom 0.305: v67.63,14.61 67.63,16.19 55.88,27.94 55.88,28.89 45.4,39.37 v44.29,39.37
21/SDA  (via drill 0.35)
  Top 0.305: R26.1 72.39,3.65 U$1.11 | v3.33,67.79 3.17,67.79
  Top 0.406: NEBULA_E.13 v20.95,80.64 | v33.66,80.64 NEBULA_H.13 | v50.16,80.64 NEBULA_D.13 | v66.67,80.64 NEBULA_G.13 | v83.19,80.64 NEBULA_C.13 | v99.69,80.64 NEBULA_B.13 | v116.2,80.64 NEBULA_F.13 | v132.72,80.64 NEBULA_A.13
  Top 0.508: NEBULA_E.13 18.72,80.82 10.15,80.82 3.17,73.84 3.17,67.79 3.17,39.37 I2C.4
  SIGNAL3 0.406: v20.95,80.64 v33.66,80.64 v50.16,80.64 v66.67,80.64 v83.19,80.64 v99.69,80.64 v116.2,80.64 v132.72,80.64
  Bottom 0.305: v3.33,67.79 13.81,67.79 J1.7
  Bottom 0.508: I2C.4 1.91,33.02 1.91,16.51 17.14,1.27 71.75,1.27 72.38,1.9 U$1.11
22/SCL  (via drill 0.35)
  Top 0.305: R27.1 80.01,3.65 U$1.14 | J1.8 15.24,73.82 21.75,80.33 21.75,80.96 20.95,81.76 v20.95,81.92
  Top 0.406: NEBULA_E.12 19.05,81.92 v20.95,81.92 | v33.66,81.92 NEBULA_H.12 | v50.16,81.92 NEBULA_D.12 | v66.67,81.92 NEBULA_G.12 | v83.19,81.92 NEBULA_C.12 | v99.69,81.92 NEBULA_B.12 | v116.2,81.92 NEBULA_F.12 | v132.72,81.92 NEBULA_A.12
  Top 0.508: I2C.3 8.26,34.92 7.62,34.29 5.08,34.29 1.91,37.47 1.91,75.56 8.26,81.92 19.05,81.92
  SIGNAL3 0.406: v20.95,81.92 v33.66,81.92 v50.16,81.92 v66.67,81.92 v83.19,81.92 v99.69,81.92 v116.2,81.92 v132.72,81.92
  Bottom 0.508: I2C.3 6.99,35.56 6.99,35.54 3.17,31.73 3.17,16.51 13.97,5.71 78.74,5.71 80,4.46 U$1.14
23  (via drill 0.35)
  Top 0.305: ULN2.8 32.23,55.24 37.62,49.85 42.55,49.85 43.34,49.05 v43.34,47.31
  Bottom 0.305: v43.34,47.31 52.7,47.31 71.12,28.89 71.12,14.92 82.39,3.65 U$1.15
25  (via drill 0.35)
  Top 0.305: v36.2,56.52 ULN2.7
  Bottom 0.305: v36.2,56.52 36.2,56.2 39.69,52.7 39.69,48.26 56.99,30.96 60.96,30.96 62.23,29.69 63.34,29.69 64.61,28.42 U$1.23
26  (via drill 0.35)
  Top 0.305: v34.13,57.78 ULN2.6
  Bottom 0.305: v34.13,57.78 34.13,57.47 39.05,52.55 39.05,47.31 56.04,30.32 60.17,30.32 62.07,28.42 U$1.24
27  (via drill 0.35)
  Top 0.305: v31.75,59.05 ULN2.5
  Bottom 0.305: v31.75,59.05 38.42,52.39 38.42,47.15 55.88,29.69 58.26,29.69 59.53,28.42 U$1.25
32  (via drill 0.35)
  Top 0.305: v31.75,60.33 ULN2.4
  Bottom 0.305: v31.75,60.33 33.5,60.33 40.32,53.5 40.32,48.42 57.15,31.59 66.52,31.59 69.69,28.42 U$1.21
33  (via drill 0.35)
  Top 0.305: v50.8,30 64.93,30 66.52,28.42 67.15,28.42 U$1.22 | v43.66,30 31.59,30 17.14,44.45 17.14,57.78 6.19,68.74 6.19,70.33 J1.2
  Bottom 0.305: v43.66,30 v50.8,30
34  (via drill 0.35)
  Top 0.305: v50.16,30.96 71.6,30.96 74.14,28.42 74.77,28.42 U$1.19 | v36.67,44.45 36.2,44.45 12.86,67.79 11.59,67.79 J1.3
  Bottom 0.305: v36.67,44.45 v50.16,30.96
35  (via drill 0.35)
  SIGNAL3 0.305: v20.64,73.98 38.1,56.52 43.5,56.52 71.6,28.42 72.23,28.42 U$1.20
  Bottom 0.305: v20.64,73.98 12.38,73.98 J1.4
36  (via drill 0.35)
  Top 0.305: v42.23,49.05 32.86,49.05 J1.5
  Bottom 0.305: v42.23,49.05 58.58,49.05 79.22,28.42 79.85,28.42 U$1.17
39  (via drill 0.35)
  Top 0.305: NEBULA_H.19 43.97,84.45 42.86,83.34 v42.86,78.9
  Bottom 0.305: U$1.18 77.31,28.42 76.68,28.42 56.83,48.26 41.91,48.26 40.96,49.21 40.96,57.78 42.86,59.69 42.86,73.18 | 42.86,73.18 v42.86,78.9 | J1.6 13.34,71.75 14.76,73.18 42.86,73.18
+3V3  (via drill 0.35)
  Top 0.508: R224.1 72.87,64.14 73.5,64.77 73.5,64.93 75.25,66.67 R133.1 76.68,66.83 77.63,67.79 79.22,67.79 | 79.22,67.79 79.38,67.79 82.87,64.29 R220.1 83.03,64.14 83.66,64.77 83.66,64.93 85.41,66.67 R137.1 86.84,66.83 87.79,67.79 89.22,67.79 92.87,64.14 R221.1 | R136.1 95.57,66.67 93.82,64.93 93.82,64.77 93.19,64.14 R221.1 | R222.1 83.03,51.44 83.66,52.07 83.66,52.23 85.41,53.98 R135.1 86.84,54.13 87.79,55.09 89.53,55.09 93.03,51.59 R223.1 | R134.1 95.57,53.98 93.82,52.23 93.82,52.07 93.19,51.44 R223.1 | R221.1 93.03,63.98 93.03,51.91 R223.1 | 26.35,81.44 26.35,76.83 C7.1 26.19,76.68 18.73,69.22 J1.9 | 27.46,82.55 NEBULA_E.18 | 27.46,82.55 26.35,81.44 | 27.46,82.55 NEBULA_E.17 28.26,82.07 31.91,85.72 NEBULA_H.9 35.56,85.57 36.35,85.57 37.78,84.14 37.78,76.83 | NEBULA_E.9 22.07,85.72 26.35,81.44 | 95.73,83.19 98.11,83.19 100.65,85.72 NEBULA_B.9 101.6,85.57 107.47,85.57 109.7,83.34 110.49,83.34 NEBULA_B.18 112.24,83.19 | 95.73,83.19 NEBULA_C.18 93.98,83.34 88.11,83.34 85.88,85.57 85.09,85.57 NEBULA_C.9 81.44,85.72 79.06,83.34 | C9.1 89.53,76.83 93.34,80.64 NEBULA_C.16 94.3,80.8 95.09,80.8 95.73,81.44 95.73,83.19 | NEBULA_G.16 NEBULA_G.17 | 79.06,83.34 77.79,82.07 NEBULA_G.17 | C13.1 71.28,76.83 74.77,80.33 | 76.99,82.55 NEBULA_G.18 | 76.99,82.55 74.77,80.33 | 76.99,82.55 77.47,82.07 NEBULA_G.17 | 37.78,76.83 42.07,76.83 NEBULA_H.15 44.61,79.53 NEBULA_H.16 44.61,80.8 NEBULA_H.17 | 37.78,76.83 C34.1 | NEBULA_H.18 44.61,82.07 NEBULA_H.17 | NEBULA_H.17 44.77,82.07 48.42,85.72 NEBULA_D.9 52.07,85.57 57.94,85.57 60.17,83.34 60.96,83.34 NEBULA_D.18 61.91,83.19 62.71,82.39
  Top 0.508: C11.1 58.58,76.83 NEBULA_D.15 61.12,79.53 61.12,80.01 | 61.12,80.01 NEBULA_D.16 | 62.71,82.39 62.71,81.44 61.28,80.01 61.12,80.01 | 62.71,82.39 66.04,85.72 NEBULA_G.9 68.58,85.57 69.53,85.57 74.77,80.33 | 79.22,67.79 79.22,83.19 79.06,83.34 | C10.1 108.11,76.83 NEBULA_B.15 110.81,79.53 111.6,79.53 112.24,80.17 112.24,83.19 | 112.24,83.19 114.62,83.19 117.16,85.72 NEBULA_F.9 118.11,85.57 123.98,85.57 127,82.55 127.16,82.55 | C12.1 124.62,76.83 NEBULA_F.15 127.32,79.53 128.11,79.53 128.75,80.17 128.75,83.34 | 127.16,82.55 NEBULA_F.18 127.32,83.34 128.75,83.34 | 127.16,82.55 NEBULA_F.17 | C8.1 136.53,76.83 140.34,80.64 | 140.34,80.64 142.88,83.19 NEBULA_A.18 158.04,83.19 | 140.34,80.64 135.25,85.72 NEBULA_A.9 134.3,85.57 133.51,85.57 131.29,83.34 128.75,83.34 | JP2.4 I2C.1 | v21.75,10.79 21.27,10.32 21.27,9.53 D91.A | R68.2 147.32,182.88 144.15,182.88 R138.2 143.99,182.56 v143.99,181.29 | 47.47,10.79 C3.1 46.98,10.79 | C22.1 | 45.4,23.34 45.4,40.64 R307.2 | 45.4,23.34 51.12,17.62 51.44,17.14 | R26.2 72.39,12.38 76.68,16.67 76.68,17.14 | 82.07,14.45 80.01,12.38 R27.2 | C27.1 | C28.1 | C29.1 | C30.1 | C31.1 | C32.1 | C33.1 | C25.1 | C24.1 | C23.1 | C21.1 | C20.1 | C19.1 | C18.1 | C17.1 | C16.1 | C15.1 | IC21.8 8.26,172.24 10.16,174.15 C26.1 | 15.88,174.31 IC20.8 | 23.5,174.31 IC19.8 | 31.11,174.31 IC18.8 | IC17.8 38.73,173.99 38.82,174.16 | 46.35,174.31 IC16.8 | 53.98,174.31 IC15.8 | 61.59,174.31 IC14.8 | 69.22,174.31 IC13.8 | 76.83,174.31 IC12.8 | 84.45,174.31 IC11.8 | 92.08,174.31 IC10.8 | 99.69,174.31 IC9.8 | 107.31,174.31 IC8.8 | 114.94,174.31 IC7.8 | 122.56,174.31 IC6.8 | 130.18,174.31 IC5.8 | 137.79,174.31 IC4.8 | 145.41,174.31 IC3.8 | 153.03,174.31 IC1.8
  Top 0.508: 142.24,174.31 v142.24,176.21 | 45.4,23.34 v40.16,18.1